# Altium project SmartCantonDevBox_V1_0.PrjPCB
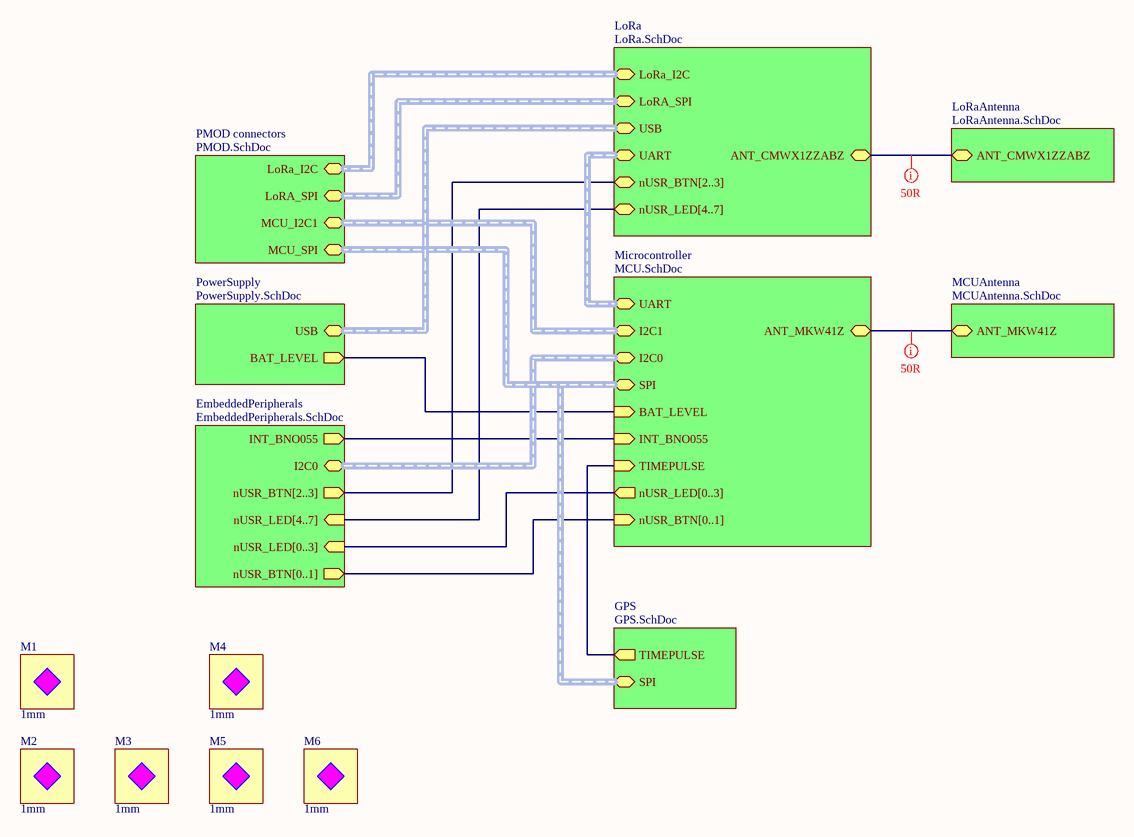
[diagram p0: SmartCantonDevBox_TopPage.SchDoc]
Engineer: David Andrade
9 sheets, 161 parts. Net scope: hierarchical (ports join the sheet entries above them; power ports are global).
Board file: SmartCantonDevBox.PcbDoc
Sheets:
  SmartCantonDevBox_TopPage.SchDoc
    GPS = GPS.SchDoc
    Microcontroller = MCU.SchDoc
    PowerSupply = PowerSupply.SchDoc
    LoRa = LoRa.SchDoc
    LoRaAntenna = LoRaAntenna.SchDoc
    MCUAntenna = MCUAntenna.SchDoc
    EmbeddedPeripherals = EmbeddedPeripherals.SchDoc
    PMOD connectors = PMOD.SchDoc

## Sheet SmartCantonDevBox_TopPage.SchDoc: Top View
size A4; Engineer: David; DocumentNumber: 1; SheetNumber: 1; SheetTotal: 9; Project: SmartCanton Dev Box; Labo: LSN; PageSetup: Record=PageOptions|CenterHorizontal=True|CenterVertical=True|PrintScale=0.97|XCorrection=1.00|YCorrection=1.00|PrintKind=1|BorderSize=5000000|LeftOffset=0|BottomOffset=0|Orientation=2|PaperLength=1000|PaperWidth=1000|Scale=100|PaperSource=7|PrintQuality=-3|MediaType=1|DitherType=10|PrintScaleMode=1|PaperKind=A4 (210 x 297 mm)|PaperIndex=9

### Parts
M1  1mm  [Losange-1mm]
M2  1mm  [Losange-1mm]
M3  1mm  [Losange-1mm]
M4  1mm  [Losange-1mm]
M5  1mm  [Losange-1mm]
M6  1mm  [Losange-1mm]

### Sub-sheets
EmbeddedPeripherals = EmbeddedPeripherals.SchDoc: I2C0 (harness I2C), INT_BNO055 (out), nUSR_LED[0..3] (in), nUSR_LED[4..7] (in), nUSR_BTN[0..1] (out), nUSR_BTN[2..3] (out)
GPS = GPS.SchDoc: SPI (harness SPI), TIMEPULSE (out)
LoRa = LoRa.SchDoc: ANT_CMWX1ZZABZ, UART (harness UART), nUSR_BTN[2..3], nUSR_LED[4..7], USB (harness USB), LoRA_SPI (harness SPI_LoRa), LoRa_I2C (harness I2C_LoRa)
LoRaAntenna = LoRaAntenna.SchDoc: ANT_CMWX1ZZABZ
MCUAntenna = MCUAntenna.SchDoc: ANT_MKW41Z
Microcontroller = MCU.SchDoc: SPI (harness SPI), I2C1 (harness I2C), I2C0 (harness I2C), ANT_MKW41Z, UART (harness UART), BAT_LEVEL (in), TIMEPULSE (in), INT_BNO055 (in), nUSR_LED[0..3] (out), nUSR_BTN[0..1] (in)
PMOD connectors = PMOD.SchDoc: MCU_SPI (harness SPI), MCU_I2C1 (harness I2C), LoRA_SPI (harness SPI_LoRa), LoRa_I2C (harness I2C_LoRa)
PowerSupply = PowerSupply.SchDoc: BAT_LEVEL (out), USB (harness USB)

### Nets
ANT: sheet LoRa/ANT_CMWX1ZZABZ, sheet LoRaAntenna/ANT_CMWX1ZZABZ
ANT_MKW41Z: sheet Microcontroller/ANT_MKW41Z, sheet MCUAntenna/ANT_MKW41Z
BAT_LEVEL: sheet Microcontroller/BAT_LEVEL, sheet PowerSupply/BAT_LEVEL
INT_BNO055: sheet Microcontroller/INT_BNO055, sheet EmbeddedPeripherals/INT_BNO055
TIMEPULSE: sheet GPS/TIMEPULSE, sheet Microcontroller/TIMEPULSE

### Buses and harness runs
bus sheet EmbeddedPeripherals/nUSR_BTN[0..1] = sheet Microcontroller/nUSR_BTN[0..1]
bus sheet EmbeddedPeripherals/nUSR_BTN[2..3] = sheet LoRa/nUSR_BTN[2..3]
bus sheet EmbeddedPeripherals/nUSR_LED[0..3] = sheet Microcontroller/nUSR_LED[0..3]
bus sheet EmbeddedPeripherals/nUSR_LED[4..7] = sheet LoRa/nUSR_LED[4..7]
harness sheet EmbeddedPeripherals/I2C0 = sheet Microcontroller/I2C0
harness sheet GPS/SPI = sheet Microcontroller/SPI = sheet PMOD connectors/MCU_SPI
harness sheet LoRa/LoRa_I2C = sheet PMOD connectors/LoRa_I2C
harness sheet LoRa/LoRA_SPI = sheet PMOD connectors/LoRA_SPI
harness sheet LoRa/UART = sheet Microcontroller/UART
harness sheet LoRa/USB = sheet PowerSupply/USB
harness sheet Microcontroller/I2C1 = sheet PMOD connectors/MCU_I2C1

### Layout directives
rule Impedance Constraint [Min = 49.50    Max = 50.50    ]; net class 50R: ANT, ANT_MKW41Z

### Notes on the sheet
- Title:
- Date:
- Project:
- Engineer:
- Revision:
- Sheet
- of
- Labo:
- File:

### Library data of the parts
M1-M6 = CMP-001-0056-A.1: Losange 1mm

## Sheet GPS.SchDoc: GPS
size A4; Engineer: David; DocumentNumber: 8; SheetNumber: 8; SheetTotal: 9; Project: SmartCanton Dev Box; Labo: LSN; PageSetup: Record=PageOptions|CenterHorizontal=True|CenterVertical=True|PrintScale=0.97|XCorrection=1.00|YCorrection=1.00|PrintKind=1|BorderSize=5000000|LeftOffset=0|BottomOffset=0|Orientation=2|PaperLength=1000|PaperWidth=1000|Scale=100|PaperSource=7|PrintQuality=-3|MediaType=1|DitherType=10|PrintScaleMode=1|PaperKind=A4 (210 x 297 mm)|PaperIndex=9
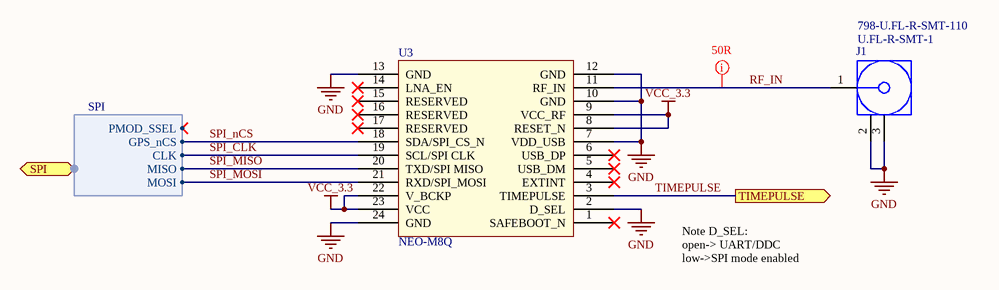
[diagram p1: GPS.SchDoc]

### Parts
J1  U.FL-R-SMT-1  Supplier Part Number 1: 798-U.FL-R-SMT-110  [U.FL-R-SMT-1]
U3  NEO-M8Q  [NEO]

### Ports
SPI (harness SPI), TIMEPULSE (out)

### Harnesses
SPI: CLK, MISO, MOSI, PMOD_SSEL, GPS_nCS

### Nets
GND: J1.2(GND) J1.3(GND) U3.2(D_SEL) U3.7(VDD_USB) U3.10(GND) U3.12(GND) U3.13(GND) U3.24(GND)
VCC_3.3: U3.8(RESET_N) U3.9(VCC_RF) U3.22(V_BCKP) U3.23(VCC)
RF_IN: J1.1(Signal) U3.11(RF_IN)
SPI_CLK: U3.19(SCL/SPI_CLK) ; port SPI.CLK  [project net KW41Z_PMOD_SCK]
SPI_MISO: U3.20(TXD/SPI_MISO) ; port SPI.MISO  [project net KW41Z_PMOD_MISO]
SPI_MOSI: U3.21(RXD/SPI_MOSI) ; port SPI.MOSI  [project net KW41Z_PMOD_MOSI]
SPI_nCS: U3.18(SDA/SPI_CS_N) ; port SPI.GPS_nCS  [project net GPS_nCS]
TIMEPULSE: U3.3(TIMEPULSE) ; port TIMEPULSE

Not connected (* = marked no-connect by the designer): U3 1(SAFEBOOT_N)* 4(EXTINT)* 5(USB_DM)* 6(USB_DP)* 14(LNA_EN)* 15(RESERVED)* 16(RESERVED)* 17(RESERVED)*

### Layout directives
net class 50R; rule Clearance Constraint [Clearance = 6.2mil]: RF_IN

### Notes on the sheet
- Note D_SEL:
  open-> UART/DDC
  low->SPI mode enabled
- Title:
- Date:
- Project:
- Engineer:
- Revision:
- Sheet
- of
- Labo:
- File:

### Library data of the parts
J1 = CMP-001-0013-A.3: Hirose U.FL SMT connector; Datasheet: https://www.hirose.com/product/en/download_file/key_name/U.FL/category/Catalog/doc_file_id/31697/?file_category_id=4&item_id=15&is_series=1; Drawing: https://www.hirose.com/product/en/download_file/key_name/U.FL-R-SMT-1%2810%29/category/Drawing%20(2D)/doc_file_id/37627/?file_category_id=6&item_id=03310472210&is_series=; Supplier 1: Mouser
U3 = CMP-001-0105-A.1: u-blox M8 concurrent GNSS LCC module, TCXO, ROM, SAW, LNA

## Sheet MCU.SchDoc: Bluetooth MCU
size A3; Engineer: David; DocumentNumber: 3; SheetNumber: 3; SheetTotal: 9; Project: SmartCanton Dev Box; Labo: LSN; PageSetup: Record=PageOptions|CenterHorizontal=True|CenterVertical=True|PrintScale=0.97|XCorrection=1.00|YCorrection=1.00|PrintKind=1|BorderSize=5000000|LeftOffset=0|BottomOffset=0|Orientation=2|PaperLength=1000|PaperWidth=1000|Scale=100|PaperSource=7|PrintQuality=-3|MediaType=1|DitherType=10|PrintScaleMode=1|PaperKind=A4 (210 x 297 mm)|PaperIndex=9
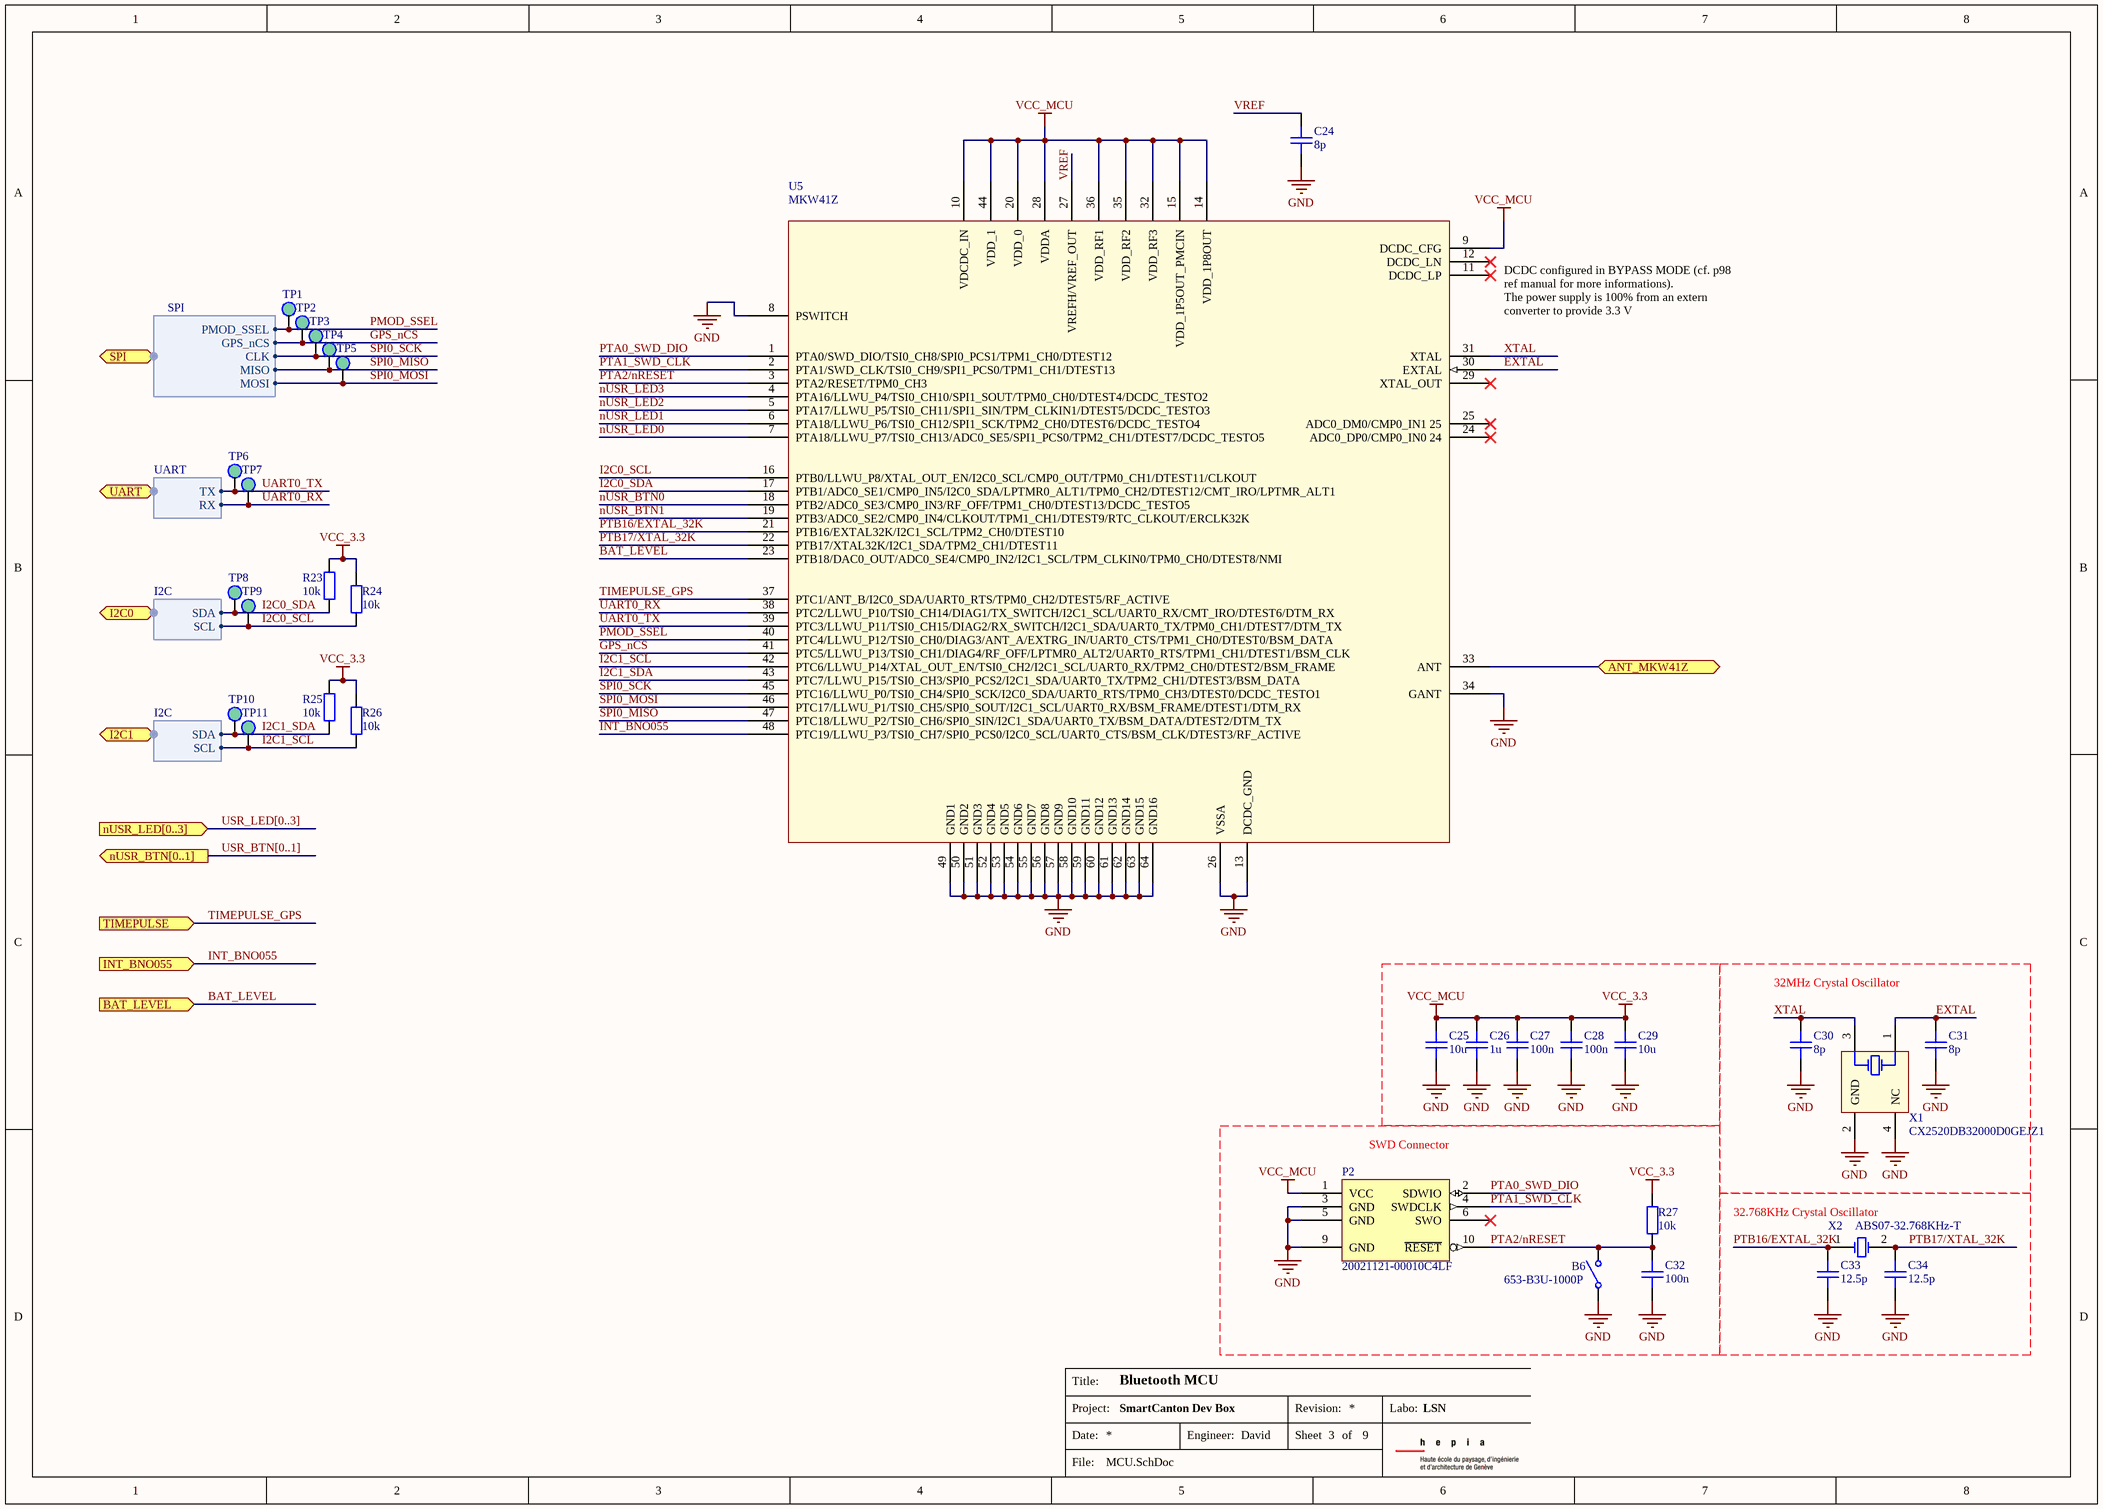
[diagram p2: MCU.SchDoc]

### Parts
B6  653-B3U-1000P  [B3U-1000P]
C24  8p  [CAPC1608X08]
C25  10u  [CAPC1608X08N]
C26  1u  [CAPC1608X08N]
C27  100n  [CAPC1608X08N]
C28  100n  [CAPC1608X08N]
C29  10u  [CAPC1608X08N]
C30  8p  [CAPC1608X08]
C31  8p  [CAPC1608X08]
C32  100n  [CAPC1608X08]
C33  12.5p  [CAPC1608X08]
C34  12.5p  [CAPC1608X08]
P2  20021121-00010C4LF  [PCBComponent]
R23  10k  [RESC1608X06]
R24  10k  [RESC1608X06]
R25  10k  [RESC1608X06]
R26  10k  [RESC1608X06]
R27  10k  [RESC1608X06]
TP1  5015  [5015]  (value not drawn)
TP2  5015  [5015]  (value not drawn)
TP3  5015  [5015]  (value not drawn)
TP4  5015  [5015]  (value not drawn)
TP5  5015  [5015]  (value not drawn)
TP6  5015  [5015]  (value not drawn)
TP7  5015  [5015]  (value not drawn)
TP8  5015  [5015]  (value not drawn)
TP9  5015  [5015]  (value not drawn)
TP10  5015  [5015]  (value not drawn)
TP11  5015  [5015]  (value not drawn)
U5  MKW41Z  [QFN50P700X700X80_HS-49M]
X1  CX2520DB32000D0GEJZ1  [AVX-CX2520DB32000D0GEJZ1-4_V]
X2  ABS07-32.768KHz-T  [ABRA-ABS07-2_V]

### Blocks framed on the sheet
32MHz Crystal Oscillator: C30 C31 X1
SWD Connector: B6 C32 P2 R27
32.768KHz Crystal Oscillator: C33 C34 X2

### Ports
ANT_MKW41Z, BAT_LEVEL (in), I2C0 (harness I2C), I2C1 (harness I2C), INT_BNO055 (in), nUSR_BTN[0..1] (out), nUSR_LED[0..3] (in), SPI (harness SPI), TIMEPULSE (in), UART (harness UART)

### Harnesses
SPI: GPS_nCS, CLK, MISO, MOSI, PMOD_SSEL
UART: TX, RX
I2C: SDA, SCL

### Nets
GND: B6.1 C24.1 C25.1 C26.1 C27.1 C28.1 C29.1 C30.1 C31.1 C32.1 C33.1 C34.1 P2.3(GND) P2.5(GND) P2.9(GND) U5.8(PSWITCH) U5.13(DCDC_GND) U5.26(VSSA) U5.34(GANT) U5.49(GND1) U5.50(GND2) U5.51(GND3) U5.52(GND4) U5.53(GND5) U5.54(GND6) U5.55(GND7) U5.56(GND8) U5.57(GND9) U5.58(GND10) U5.59(GND11) U5.60(GND12) U5.61(GND13) U5.62(GND14) U5.63(GND15) U5.64(GND16) X1.2(GND) X1.4(NC)
VCC_3.3: C25.2 C26.2 C27.2 C28.2 C29.2 P2.1(VCC) R23.2 R24.2 R25.2 R26.2 R27.1 U5.9(DCDC_CFG) U5.10(VDCDC_IN) U5.14(VDD_1P8OUT) U5.15(VDD_1P5OUT_PMCIN) U5.20(VDD_0) U5.28(VDDA) U5.32(VDD_RF3) U5.35(VDD_RF2) U5.36(VDD_RF1) U5.44(VDD_1)  [also labelled VCC_MCU]
ANT_MKW41Z: U5.33(ANT) ; port ANT_MKW41Z
BAT_LEVEL: U5.23(PTB18/DAC0_OUT/ADC0_SE4/CMP0_IN2/I2C1_SCL/TPM_CLKIN0/TPM0_CH0/DTEST8/NMI) ; port BAT_LEVEL
EXTAL: C31.2 U5.30(EXTAL) X1.1(HOT)
GPS_nCS: TP2.1(TP) U5.41(PTC5/LLWU_P13/TSI0_CH1/DIAG4/RF_OFF/LPTMR0_ALT2/UART0_RTS/TPM1_CH1/DTEST1/BSM_CLK) ; port SPI.GPS_nCS
I2C0_SCL: R24.1 TP9.1(TP) U5.16(PTB0/LLWU_P8/XTAL_OUT_EN/I2C0_SCL/CMP0_OUT/TPM0_CH1/DTEST11/CLKOUT) ; port I2C0.SCL
I2C0_SDA: R23.1 TP8.1(TP) U5.17(PTB1/ADC0_SE1/CMP0_IN5/I2C0_SDA/LPTMR0_ALT1/TPM0_CH2/DTEST12/CMT_IRO/LPTMR_ALT1) ; port I2C0.SDA
I2C1_SCL: R26.1 TP11.1(TP) U5.42(PTC6/LLWU_P14/XTAL_OUT_EN/TSI0_CH2/I2C1_SCL/UART0_RX/TPM2_CH0/DTEST2/BSM_FRAME) ; port I2C1.SCL
I2C1_SDA: R25.1 TP10.1(TP) U5.43(PTC7/LLWU_P15/TSI0_CH3/SPI0_PCS2/I2C1_SDA/UART0_TX/TPM2_CH1/DTEST3/BSM_DATA) ; port I2C1.SDA
INT_BNO055: U5.48(PTC19/LLWU_P3/TSI0_CH7/SPI0_PCS0/I2C0_SCL/UART0_CTS/BSM_CLK/DTEST3/RF_ACTIVE) ; port INT_BNO055
nUSR_BTN0: U5.18(PTB2/ADC0_SE3/CMP0_IN3/RF_OFF/TPM1_CH0/DTEST13/DCDC_TESTO5)
nUSR_BTN1: U5.19(PTB3/ADC0_SE2/CMP0_IN4/CLKOUT/TPM1_CH1/DTEST9/RTC_CLKOUT/ERCLK32K)
nUSR_LED0: U5.7(PTA18/LLWU_P7/TSI0_CH13/ADC0_SE5/SPI1_PCS0/TPM2_CH1/DTEST7/DCDC_TESTO5)
nUSR_LED1: U5.6(PTA18/LLWU_P6/TSI0_CH12/SPI1_SCK/TPM2_CH0/DTEST6/DCDC_TESTO4)
nUSR_LED2: U5.5(PTA17/LLWU_P5/TSI0_CH11/SPI1_SIN/TPM_CLKIN1/DTEST5/DCDC_TESTO3)
nUSR_LED3: U5.4(PTA16/LLWU_P4/TSI0_CH10/SPI1_SOUT/TPM0_CH0/DTEST4/DCDC_TESTO2)
PMOD_SSEL: TP1.1(TP) U5.40(PTC4/LLWU_P12/TSI0_CH0/DIAG3/ANT_A/EXTRG_IN/UART0_CTS/TPM1_CH0/DTEST0/BSM_DATA) ; port SPI.PMOD_SSEL  [project net KW41Z_PMOD_SSEL]
PTA0_SWD_DIO: P2.2(SDWIO) U5.1(PTA0/SWD_DIO/TSI0_CH8/SPI0_PCS1/TPM1_CH0/DTEST12)
PTA1_SWD_CLK: P2.4(SWDCLK) U5.2(PTA1/SWD_CLK/TSI0_CH9/SPI1_PCS0/TPM1_CH1/DTEST13)
PTA2/nRESET: B6.2 C32.2 P2.10(~{RESET}) R27.2 U5.3(PTA2/RESET/TPM0_CH3)
PTB16/EXTAL_32K: C33.2 U5.21(PTB16/EXTAL32K/I2C1_SCL/TPM2_CH0/DTEST10) X2.1(X1)
PTB17/XTAL_32K: C34.2 U5.22(PTB17/XTAL32K/I2C1_SDA/TPM2_CH1/DTEST11) X2.2(X2)
SPI0_MISO: TP4.1(TP) U5.47(PTC18/LLWU_P2/TSI0_CH6/SPI0_SIN/I2C1_SDA/UART0_TX/BSM_DATA/DTEST2/DTM_TX) ; port SPI.MISO  [project net KW41Z_PMOD_MISO]
SPI0_MOSI: TP5.1(TP) U5.46(PTC17/LLWU_P1/TSI0_CH5/SPI0_SOUT/I2C1_SCL/UART0_RX/BSM_FRAME/DTEST1/DTM_RX) ; port SPI.MOSI  [project net KW41Z_PMOD_MOSI]
SPI0_SCK: TP3.1(TP) U5.45(PTC16/LLWU_P0/TSI0_CH4/SPI0_SCK/I2C0_SDA/UART0_RTS/TPM0_CH3/DTEST0/DCDC_TESTO1) ; port SPI.CLK  [project net KW41Z_PMOD_SCK]
TIMEPULSE_GPS: U5.37(PTC1/ANT_B/I2C0_SDA/UART0_RTS/TPM0_CH2/DTEST5/RF_ACTIVE) ; port TIMEPULSE  [project net TIMEPULSE]
UART0_RX: TP7.1(TP) U5.38(PTC2/LLWU_P10/TSI0_CH14/DIAG1/TX_SWITCH/I2C1_SCL/UART0_RX/CMT_IRO/DTEST6/DTM_RX) ; port UART.RX
UART0_TX: TP6.1(TP) U5.39(PTC3/LLWU_P11/TSI0_CH15/DIAG2/RX_SWITCH/I2C1_SDA/UART0_TX/TPM0_CH1/DTEST7/DTM_TX) ; port UART.TX
VREF: C24.2 U5.27(VREFH/VREF_OUT)
XTAL: C30.2 U5.31(XTAL) X1.3(HOT)

Not connected (* = marked no-connect by the designer): P2 6(SWO)*; U5 11(DCDC_LP)* 12(DCDC_LN)* 24(ADC0_DP0/CMP0_IN0_24)* 25(ADC0_DM0/CMP0_IN1_25)* 29(XTAL_OUT)*

### Buses and harness runs
bus USR_BTN[0..1] = port nUSR_BTN[0..1]
bus USR_LED[0..3] = port nUSR_LED[0..3]

### Notes on the sheet
- DCDC configured in BYPASS MODE (cf. p98 ref manual for more informations).
  The power supply is 100% from an extern converter to provide 3.3 V
- Title:
- Date:
- Project:
- Engineer:
- Revision:
- Sheet
- of
- Labo:
- File:

### Library data of the parts
B6 = PUSH_BUTTON: Supplier 1: Mouser; Supplier Part Number 1: 653-B3U-1000P
C24 C30 C31 C33 C34 = CMP-001-0010-A.3: MLCC Capacitor 1608; RevisionId: A.2; AccessRights: 2147483647; Folder: LSN\Components\Passifs\Condensateurs\; ContentType: Component; LifeCycleStateGUID: 706004B5-C76E-482E-903B-BA0E4FAE086A; ReleaseDate: 31/10/2016 02:21:03 PM; ContentTypeGUID: CB3C11C4-E317-11DF-B822-12313F0024A2; ItemGUID: 6B05C9AF-D3C2-4723-98C2-0E51694C471A; ItemHRID: CMP-001-0010; FolderGUID: 9DA6C5B0-B134-4C0D-99DA-A840DED25FBD; LifeCycle: New From Design; ComponentType: Capacitor
  C24 C30 C31: Value: 8p
  C33 C34: Value: 12.5p
C25-C29 = CMP-001-0010-A.1: MLCC Capacitor 1608
  C25 C29: Value: 10u
  C26: Value: 1u
  C27 C28: Value: 100n
C32 = CMP-001-0010-A.3: MLCC Capacitor 1608; AccessRights: 2147483647; ContentType: Component; Folder: LSN\Components\Passifs\Condensateurs\; RevisionId: A.2; Value: 100n; ComponentType: Capacitor; ContentTypeGUID: CB3C11C4-E317-11DF-B822-12313F0024A2; FolderGUID: 9DA6C5B0-B134-4C0D-99DA-A840DED25FBD; ItemGUID: 6B05C9AF-D3C2-4723-98C2-0E51694C471A; ItemHRID: CMP-001-0010; LifeCycle: New From Design; LifeCycleStateGUID: 706004B5-C76E-482E-903B-BA0E4FAE086A; ReleaseDate: 31/10/2016 02:21:03 PM
P2 = CMP-001-0019-A.2: Minitek127®  :  1.27x1.27MM BTB, HEADER UNSHROUDED, SMT, 10 POSITIONS; Supplier 1: Mouser; Supplier Part Number 1: 649-202112100010C4LF
R23-R27 = CMP-001-0005-A.4: 1608 resistor; Value: 10k
TP1-TP11 = CMP-001-0108-A.3: Circuit Board Hardware - PCB MINI SMT TEST POINT
U5 = CMP-001-0100-A.1: 2.4 GHz Bluetooth Low Energy ver. 4.2 compliant, Up to 48 MHz ARM® Cortex-M0+ core, On-chip 512/256 KB Flash memory, On-chip 128/64 KB SRAM; Supplier 1: Mouser; Supplier Part Number 1: 841-MKW41Z512VHT4
X1 = CMP-0449-00001-2: Crystal, 32 MHz, 8 pF, -10 to 70 degC, Surface Mount 2.5 x 2.0 mm; Manufacturer: Kyocera; Load Capacitance: 8 pF; Frequency Range: 32000 kHz; Packing: Tape and Reel; Motional Series Resistance: 50 ohm (max); Drive Level: 10uW (100uW max.); ComponentLink3Description: Package Specification; ComponentLink1Description: Manufacturer URL; ComponentLink2Description: Datasheet; PackageDescription: 4-Pin Hand Drawnï¼ŒBody 2.5x2mm; ComponentLink1URL: http://global.kyocera.com/; ComponentLink3URL: http://global.kyocera.com/prdct/electro/pdf/xtal/cx2520db_cs_e.pdf; Operating Temperature: -10 to 70 degC; ComponentLink2URL: http://global.kyocera.com/prdct/electro/pdf/xtal/cx2520db_cs_e.pdf; PartNumber: CX2520DB32000D0GEJZ1; PackageReference: CX2520DB32000D0GEJZ1-4; Mounting Technology: Surface Mount; Supplier 1: Mouser; Supplier Part Number 1: 581-CX2520DB32DGEJZ1
X2 = CMP-0447-00001-2: Crystal, 32.768 kHz, 12.5 pF, -40 to 85 degC, SMD Low Profile 3.2 x 1.5 x 0.9 mm, Tape and Reel; Manufacturer: Abracon; Q Value (Type): 30000; Operation Mode: Flexural Mode (Tuning Fork); Shunt Capacitance (C0): 0.9 to 1.2 pF; Load Capacitance (CL): 12.5 pF; Frequency Tolerance @+25degC: +/- 20 ppm; Drive Level (Type): 0.1 uW; Equivalent Series Resistance (R1): 70 Kohm; Insulation Resistance (Min): 500 Mohm; ComponentLink3URL: http://www.abracon.com/Resonators/ABS07.pdf; PackageDescription: 2-Pin Hand Drawn, Body 3.2x1.5mm, Pitch 2.5mm; Operating Temperature: -40 to 85 degC; ComponentLink2URL: http://www.abracon.com/Resonators/ABS07.pdf; PackageReference: ABS07-2; ComponentLink3Description: Package Specification; ComponentLink1Description: Manufacturer URL; DatasheetVersion: 04.03.13; Mounting Technology: Surface Mount; ComponentLink2Description: Datasheet; ComponentLink1URL: http://www.abracon.com/; PartNumber: ABS07-32.768KHz-T; Packing: Tape and Reel; Frequency: 32.768 kHz; Supplier 1: Mouser; Supplier Part Number 1: 815-ABS07-32.768KHZT

## Sheet PowerSupply.SchDoc: Power Supply
size A4; Engineer: David; DocumentNumber: 2; SheetNumber: 2; SheetTotal: 9; Project: SmartCanton Dev Box; Labo: LSN; PageSetup: Record=PageOptions|CenterHorizontal=True|CenterVertical=True|PrintScale=0.97|XCorrection=1.00|YCorrection=1.00|PrintKind=1|BorderSize=5000000|LeftOffset=0|BottomOffset=0|Orientation=2|PaperLength=1000|PaperWidth=1000|Scale=100|PaperSource=7|PrintQuality=-3|MediaType=1|DitherType=10|PrintScaleMode=1|PaperKind=A4 (210 x 297 mm)|PaperIndex=9; ProjectName: SmartCanton Dev Box
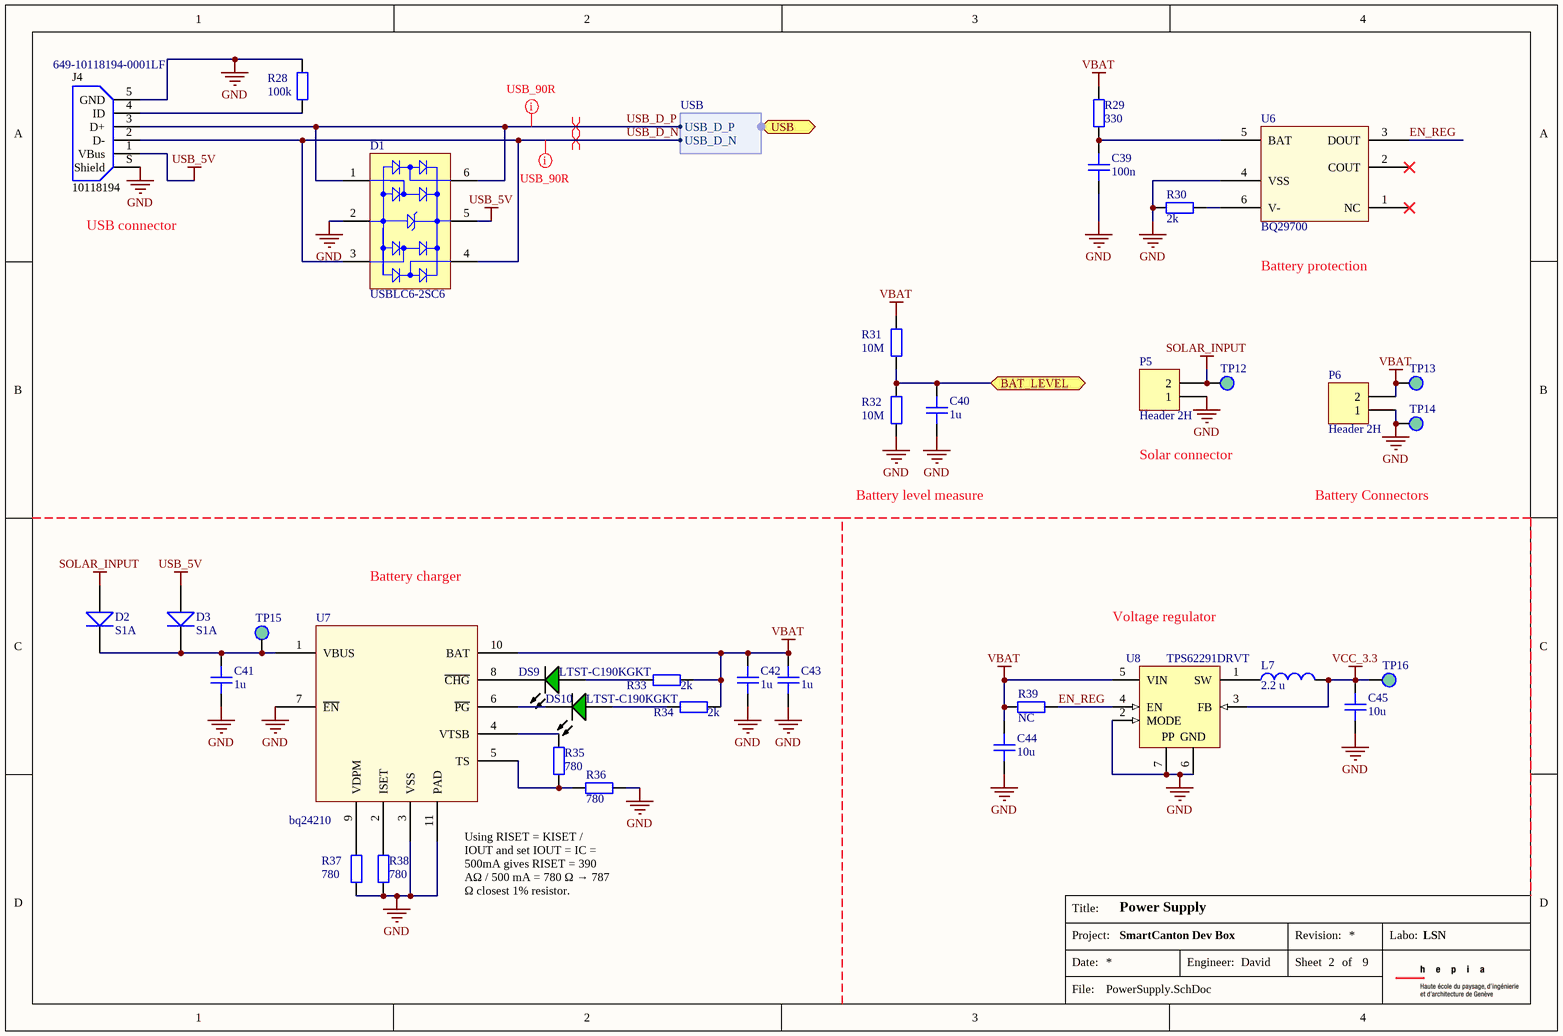
[diagram p3: PowerSupply.SchDoc]

### Parts
C39  100n  [CAPC1608X08]
C40  1u  [CAPC1608X08]
C41  1u  [CAPC1608X08]
C42  1u  [CAPC1608X08]
C43  1u  [CAPC1608X08]
C44  10u  [CAPC2012X14]
C45  10u  [CAPC2012X14]
D1  USBLC6-2SC6  [STM-SOT23-6L_V]
D2  S1A  [DO-214AC]
D3  S1A  [DO-214AC]
DS9  LTST-C190KGKT  [LITE-ON-LTST-C190GKT-2_V]
DS10  LTST-C190KGKT  [LITE-ON-LTST-C190GKT-2_V]
J4  10118194  Supplier Part Number 1: 649-10118194-0001LF  [10118194-0001LF]
L7  2.2 u  [TDK-IND0805-125_V]
P5  Header 2H  [HDR1X2H]
P6  Header 2H  [HDR1X2H]
R28  100k  [RESC1608X06]
R29  330  [RESC1608X06]
R30  2k  [RESC1608X06]
R31  10M  [RESC1608X06]
R32  10M  [RESC1608X06]
R33  2k  [RESC1608X06]
R34  2k  [RESC1608X06]
R35  780  [RESC1608X06]
R36  780  [RESC1608X06]
R37  780  [RESC1608X06]
R38  780  [RESC1608X06]
R39  NC  [RESC1608X06]
TP12  5015  [5015]  (value not drawn)
TP13  5015  [5015]  (value not drawn)
TP14  5015  [5015]  (value not drawn)
TP15  5015  [5015]  (value not drawn)
TP16  5015  [5015]  (value not drawn)
U6  BQ29700  [SON50P150X75-6M]
U7  bq24210  [WSON50P200X300X80-11N]
U8  TPS62291DRVT  [DRV0006A_V]

### Ports
BAT_LEVEL, USB (harness USB)

### Harnesses
USB: USB_D_P, USB_D_N

### Nets
GND: C39.1 C40.1 C41.1 C42.1 C43.1 C44.2 C45.2 D1.2(GND) J4.5(GND) J4.S(Shield) P5.1 P6.1 R28.2 R30.1 R32.1 R36.1 R37.1 R38.1 TP14.1(TP) U6.4(VSS) U7.3(VSS) U7.7(~{EN}) U7.11(PAD) U8.2(MODE) U8.6(GND) U8.7(EP)
SOLAR_INPUT: D2.A P5.2 TP12.1(TP)
USB_5V: D1.5(VBUS) D3.A J4.1(VBus)
VBAT: C42.2 C43.2 C44.1 P6.2 R29.2 R31.2 R33.1 R34.1 R39.2 TP13.1(TP) U7.10(BAT) U8.5(VIN)
VCC_3.3: C45.1 L7.2 TP16.1(TP) U8.3(FB)
BAT_LEVEL: C40.2 R31.1 R32.2 ; port BAT_LEVEL
EN_REG: R39.1 U6.3(DOUT) U8.4(EN)
USB_D_N: D1.3(I/O_2) D1.4(I/O_3) J4.2(D-) ; port USB.USB_D_N
USB_D_P: D1.1(I/O_1) D1.6(I/O_4) J4.3(D+) ; port USB.USB_D_P
NetC39_2: C39.2 R29.1 U6.5(BAT)
NetC41_2: C41.2 D2.K D3.K TP15.1(TP) U7.1(VBUS)
NetDS9_1: DS9.1(A) R33.2
NetDS9_2: DS9.2(K) U7.8(~{CHG})
NetDS10_1: DS10.1(A) R34.2
NetDS10_2: DS10.2(K) U7.6(~{PG})
NetJ4_4: J4.4(ID) R28.1
NetL7_1: L7.1 U8.1(SW)
NetR30_2: R30.2 U6.6(V-)
NetR35_1: R35.1 R36.2 U7.5(TS)
NetR35_2: R35.2 U7.4(VTSB)
NetR37_2: R37.2 U7.9(VDPM)
NetR38_2: R38.2 U7.2(ISET)

Not connected (* = marked no-connect by the designer): U6 1(NC)* 2(COUT)*

### Layout directives
differential pair; net class USB_90R: USB_D_N, USB_D_P
rule Impedance Constraint [Min = 90.00    Max = 90.00    ]; net class USB_90R: USB_D_N, USB_D_P

### Notes on the sheet
- (near J4) USB connector
- (near U6) Battery protection
- Battery level measure
- Solar connector
- Battery Connectors
- Battery charger
- Voltage regulator
- Using RISET = KISET / IOUT and set IOUT = IC = 500mA gives RISET = 390 AΩ / 500 mA = 780 Ω → 787 Ω closest 1% resistor.
- Title:
- Date:
- Project:
- Engineer:
- Revision:
- Sheet
- of
- Labo:
- File:
- (in symbol CMP-00017-A.1) PP

### Library data of the parts
C39-C43 = CMP-001-0010-A.3: as C24 on sheet MCU; LifeCycleStateGUID: 706004B5-C76E-482E-903B-BA0E4FAE086A; ReleaseDate: 31/10/2016 02:21:03 PM; ContentTypeGUID: CB3C11C4-E317-11DF-B822-12313F0024A2; ItemGUID: 6B05C9AF-D3C2-4723-98C2-0E51694C471A; ItemHRID: CMP-001-0010; FolderGUID: 9DA6C5B0-B134-4C0D-99DA-A840DED25FBD; LifeCycle: New From Design; ComponentType: Capacitor
  C39: Value: 100n
  C40-C43: Value: 1u
C44 C45 = CMP-001-0011-A.3: MLCC Capacitor 2012; RevisionId: A.2; AccessRights: 2147483647; Folder: LSN\Components\Passifs\Condensateurs\; ContentType: Component; LifeCycleStateGUID: 706004B5-C76E-482E-903B-BA0E4FAE086A; ReleaseDate: 31/10/2016 02:37:45 PM; ContentTypeGUID: CB3C11C4-E317-11DF-B822-12313F0024A2; ItemGUID: A3557974-B927-469A-A63C-1E583F58844C; ItemHRID: CMP-001-0011; FolderGUID: 9DA6C5B0-B134-4C0D-99DA-A840DED25FBD; LifeCycle: New From Design; ComponentType: Capacitor; Value: 10u
D1 = CMP-2000-05378-1: Very low capacitance ESD protection, 3.5 pF, -40 to 125 degC, 6-Pin SOT23, RoHS, Tape and Reel; Manufacturer: STMicroelectronics; Polarity: Uni-Directional; Clamping Voltage: 17V; Rad Hardened: No; Product Height (mm): 1.3mm; Leakage Current (Max): 0.15uA; Product Length (mm): 3.05mm; Number of Elements: 1; Peak Pulse Current: 5A; Configuration: Dual; Reverse Breakdown Voltage: 6V; Working Voltage (Max): 5V; Capacitance Value: 3.5pF; Suppressor Type: DiodeArrays; Product Depth (mm): 1.75mm; Test Current (It): 1mA; Package / Case: SOT-23; Operating Temperature Max Deg. C: 125C; Package Description: 6-Pin Small Outline Transistor, Body 2.925 x 1.625 mm, Pitch 0.95 mm; Package Reference: SOT23-6L; Datasheet Version: Rev. 5, 10/2011; Operating Temperature Min Deg. C: -40C; Mounting Style: SurfaceMount; Direction Type: Uni-Directional; Mounting: SurfaceMount; Pin Count: 6; Leakage Current: 0.15uA; Packaging: TapeandReel; Operating Temperature Classification: Automotive; Clamping Voltage (Max): 17V; Manufacturer URL: http://www.st.com/; Reverse Stand-off Voltage: 5V; Datasheet URL: http://www.st.com/st-web-ui/static/active/en/resource/technical/document/datasheet/CD00050750.pdf; Working Voltage: 5V; Operating Temp Range: -40Cto125C; Supplier 1: Mouser; Supplier Part Number 1: 511-USBLC6-2SC6
D2 D3 = CMP-001-0034-A.1: General-Purpose Rectifier, Vrrm = 50V
DS9 DS10 = CMP-00026-A.1: LED Uni-Color Green, 75 mW, 5 V, -30 to 85 degC, 2-Pin SMD, RoHS, Tape and Reel; Manufacturer: Lite-On; Reverse Voltage: 5V; Product Depth (mm): 0.8mm; Forward Voltage: 2.4V; Rad Hardened: No; High Brightness: Yes; Forward Current: 30mA; Viewing Angle: 130deg; Test Current (It): 20mA; Emitting Color: YellowGreen; Number of Elements: 1; Luminous Intensity: 35mcd; Chip Material: AlGaInP; Shape Type: Rectangular; Dominant Wave Length: 571nm; Peak Wavelength: 574nm; Main Category: ChipLED; DELETED: Compliant; Product Length (mm): 1.6mm; Power Dissipation: 75W; Package Reference: C190KGKT; Mounting: SurfaceMount; Package Description: 2-Pin Surface Mount Device, Body 1.6 x 0.8 mm; Datasheet Version: Jul-15; Operating Temperature Classification: Industrial; Packaging: TapeandReel; Lens Dimensions: 1.1X0.8X0.52mm; Type: Uni-Color; Manufacturer URL: http://www.us.liteon.com/; Datasheet URL: http://datasheet.octopart.com/LTST-C190KGKT-Lite-On-datasheet-43775815.pdf; Product Height (mm): 0.8mm; Operating Temp Range: -55Cto85C; Pin Count: 2; Package Type: ChipLed; Lum Intensity: 35mcd; Supplier 1: Mouser; Supplier Part Number 1: 859-LTST-C190KGKT
J4 = CMP-001-0075-A.1: Supplier 1: Mouser
L7 = CMP-0266-00001-1: Multilayer Inductor, 2.2 uH, ±20%, 300 mOhm, 50MHz, 0805(2012); PartNumber: MLZ2012N100LT; DC Resistance: 0.3 Ohm; PackageReference: IND0805-125; ComponentLink1URL: http://www.global.tdk.com/; DatasheetVersion: 05/2013; ComponentLink2Description: Datasheet; ComponentLink1Description: Manufacturer URL; Mounting Technology: Suface Mount; ComponentLink2URL: http://www.tdk.co.jp/tcfx01/c533_mlz.pdf; PackageDescription: 2-Pin SMT Inductor, 2 x 1.25 mm Body; Supplier 1: Mouser; Supplier Part Number 1: 810-MLZ2012N2R2LT000
P5 P6 = Header 2H: Header, 2-Pin, Right Angle; LatestRevisionDate: 17-Jul-2002; LatestRevisionNote: Re-released for DXP Platform.; Publisher: Altium Limited
  P5: Supplier 1: Mouser; Supplier Part Number 1: 538-22-05-3021
  P6: Supplier 1: Digi-Key; Supplier Part Number 1: WM4300-ND
R28-R39 = CMP-001-0005-A.4: 1608 resistor
  R28: Value: 100k
  R29: Value: 330
  R30 R33 R34: Value: 2k
  R31 R32: Value: 10M
  R35-R38: Value: 780
  R39: Value: NC
TP12-TP16 = CMP-001-0108-A.3: as TP1 on sheet MCU
U6 = CMP-001-0114-A.2: Supplier 1: Mouser; Supplier Part Number 1: 595-BQ29700DSET
U7 = CMP-001-0111-A.1: 800-mA, Single-Input, Single-Cell Li-Ion Battery Solar Charger; Supplier 1: Mouser; Supplier Part Number 1: 595-BQ24210DQCT
U8 = CMP-00017-A.1: Buck Step Down Regulator with 2.3 to 6 V Input and 3.3 V Output, -40 to 85 degC, 6-Pin SON (DRV), Green (RoHS & no Sb/Br); Manufacturer: Texas Instruments; Preset Vout(V): 3.3; Switch Current Limit(Typ)(A): 1.4; Synchronous Rectification: TRUE; Duty Cycle(Max)(%): 100; Iout(Max)(A): 1; Vin(Max)(V): 6; Iq(Typ)(mA): 0.015; Rating: Catalog; SubFamily: Step-Down Regulator; Vin(Min)(V): 2.3; PartNumber: TPS62291DRVT; Mounting Technology: Surface Mount; ComponentLink2Description: Package Specification; Topology: Buck; ComponentLink1Description: Datasheet; Eco-Plan: Green (RoHS & no Sb/Br); Regulated Outputs(#): 1; ComponentLink1URL: http://www.ti.com/general/docs/lit/getliterature.tsp?genericPartNumber=TPS62291&fileType=pdf; DatasheetVersion: SLVS764C; ComponentLink3Description: URL Link1; Vout(Min)(V): 3.3; Vout(Max)(V): 3.3; PackageDescription: 6-Pin Plastic Small Outline No-Lead, 2 x 2 x 0.8 mm Body, 0.65 mm Pitch, Exposed Pad; ComponentLink2URL: http://www.ti.com/litv/pdf/mpds216d; PackageReference: DRV0006A; ComponentLink3URL: Samples URL:http://www.ti.com/product/tps62291#samples; PackageVersion: revE, Oct-2010; Supplier 1: Mouser; Supplier Part Number 1: 595-TPS62291DRVT

## Sheet LoRa.SchDoc: LoRa MCU
size A4; Engineer: David; DocumentNumber: 5; SheetNumber: 5; SheetTotal: 9; Project: SmartCanton Dev Box; Labo: LSN; PageSetup: Record=PageOptions|CenterHorizontal=True|CenterVertical=True|PrintScale=0.97|XCorrection=1.00|YCorrection=1.00|PrintKind=1|BorderSize=5000000|LeftOffset=0|BottomOffset=0|Orientation=2|PaperLength=1000|PaperWidth=1000|Scale=100|PaperSource=7|PrintQuality=-3|MediaType=1|DitherType=10|PrintScaleMode=1|PaperKind=A4 (210 x 297 mm)|PaperIndex=9
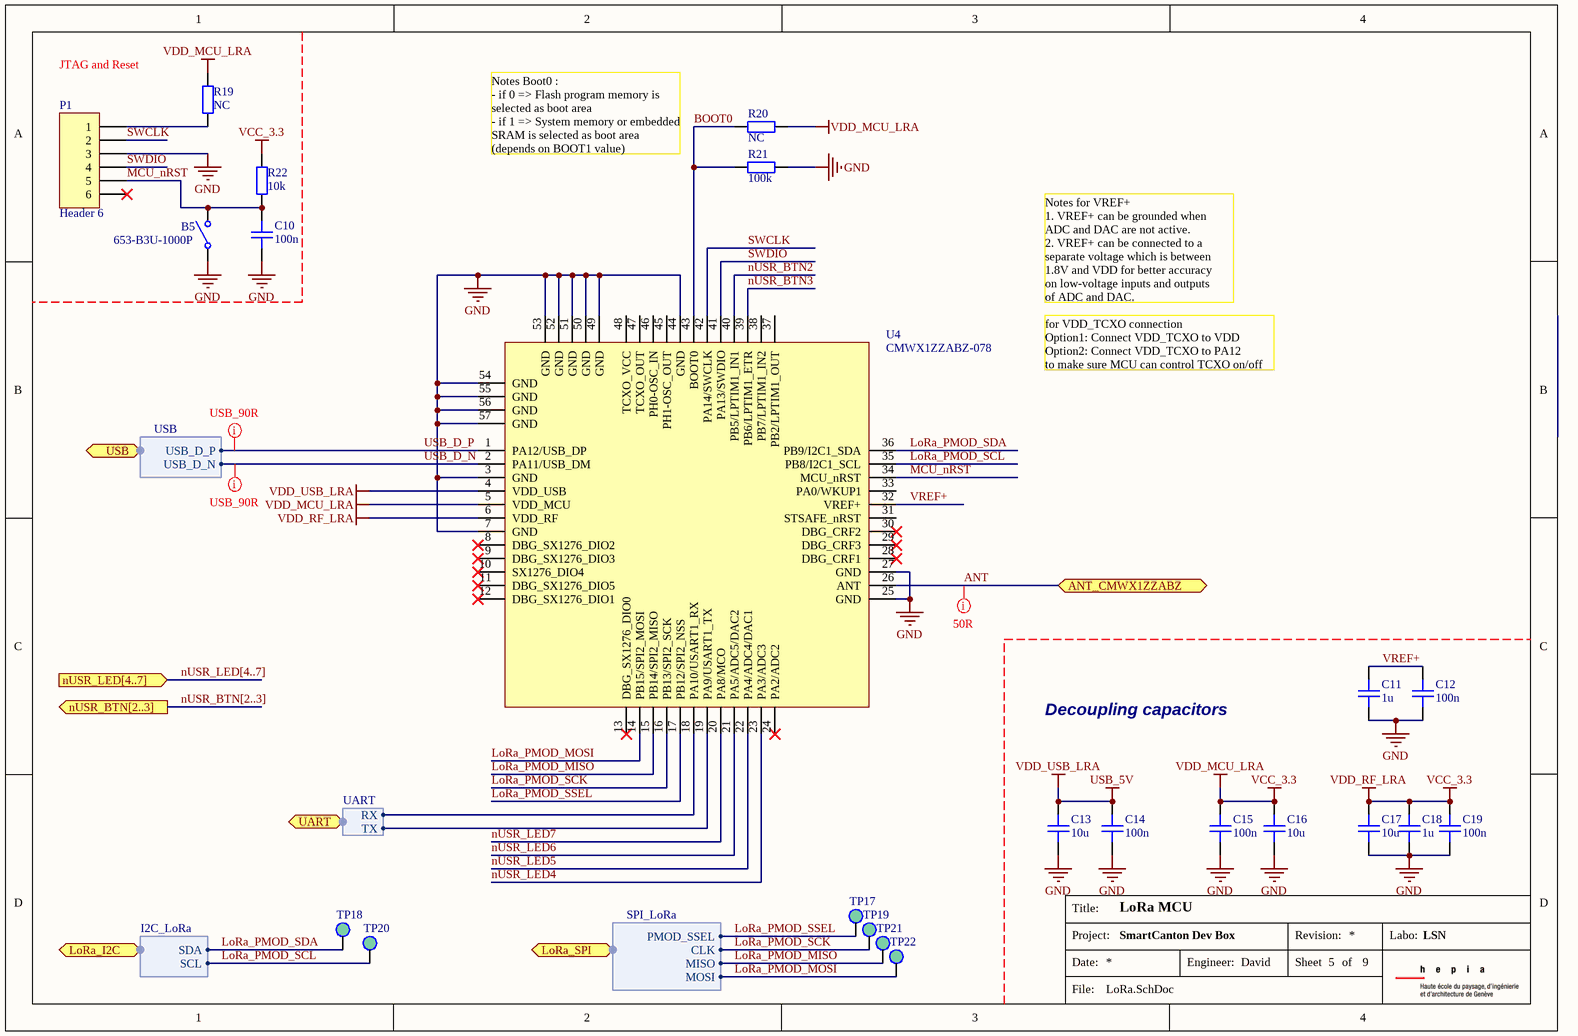
[diagram p4: LoRa.SchDoc]

### Parts
B5  653-B3U-1000P  [B3U-1000P]
C10  100n  [CAPC1608X08]
C11  1u  [CAPC1608X08N]
C12  100n  [CAPC1608X08N]
C13  10u  [CAPC1608X08N]
C14  100n  [CAPC1608X08N]
C15  100n  [CAPC1608X08N]
C16  10u  [CAPC1608X08N]
C17  10u  [CAPC1608X08N]
C18  1u  [CAPC1608X08N]
C19  100n  [CAPC1608X08N]
P1  Header 6  [HDR1X6]
R19  NC  [RESC1608X06]
R20  NC  [RESC1608X06]
R21  100k  [RESC1608X06]
R22  10k  [RESC1608X06]
TP17  5015  [5015]  (value not drawn)
TP18  5015  [5015]  (value not drawn)
TP19  5015  [5015]  (value not drawn)
TP20  5015  [5015]  (value not drawn)
TP21  5015  [5015]  (value not drawn)
TP22  5015  [5015]  (value not drawn)
U4  CMWX1ZZABZ-078  [CMWX1ZZABZ-078]

### Ports
ANT_CMWX1ZZABZ, LoRa_I2C (harness I2C_LoRa), LoRa_SPI (harness SPI_LoRa), nUSR_BTN[2..3] (out), nUSR_LED[4..7] (in), UART (harness UART), USB (harness USB)

### Harnesses
UART: RX, TX
SPI_LoRa: PMOD_SSEL, CLK, MISO, MOSI
I2C_LoRa: SDA, SCL
USB: USB_D_P, USB_D_N

### Nets
GND: B5.1 C10.1 C11.1 C12.1 C13.1 C14.1 C15.1 C16.1 C17.1 C18.1 C19.1 P1.3 R21.2 U4.3(GND) U4.7(GND) U4.25(GND) U4.27(GND) U4.44(GND) U4.49(GND) U4.50(GND) U4.51(GND) U4.52(GND) U4.53(GND) U4.54(GND) U4.55(GND) U4.56(GND) U4.57(GND)
USB_5V: C13.2 C14.2 U4.4(VDD_USB)  [also labelled VDD_USB_LRA]
VCC_3.3: C15.2 C16.2 C17.2 C18.2 C19.2 R19.1 R20.2 R22.1 U4.5(VDD_MCU) U4.6(VDD_RF)  [also labelled VDD_MCU_LRA, VDD_RF_LRA]
ANT: U4.26(ANT) ; port ANT_CMWX1ZZABZ
BOOT0: R20.1 R21.1 U4.43(BOOT0)
LoRa_PMOD_MISO: TP21.1(TP) U4.15(PB14/SPI2_MISO) ; port LoRa_SPI.MISO
LoRa_PMOD_MOSI: TP22.1(TP) U4.14(PB15/SPI2_MOSI) ; port LoRa_SPI.MOSI
LoRa_PMOD_SCK: TP19.1(TP) U4.16(PB13/SPI2_SCK) ; port LoRa_SPI.CLK
LoRa_PMOD_SCL: TP20.1(TP) U4.35(PB8/I2C1_SCL) ; port LoRa_I2C.SCL
LoRa_PMOD_SDA: TP18.1(TP) U4.36(PB9/I2C1_SDA) ; port LoRa_I2C.SDA
LoRa_PMOD_SSEL: TP17.1(TP) U4.17(PB12/SPI2_NSS) ; port LoRa_SPI.PMOD_SSEL
MCU_nRST: B5.2 C10.2 P1.5 R22.2 U4.34(MCU_nRST)
nUSR_BTN2: U4.40(PB5/LPTIM1_IN1)
nUSR_BTN3: U4.39(PB6/LPTIM1_ETR)
nUSR_LED4: U4.23(PA3/ADC3)
nUSR_LED5: U4.22(PA4/ADC4/DAC1)
nUSR_LED6: U4.21(PA5/ADC5/DAC2)
nUSR_LED7: U4.20(PA8/MCO)
SWCLK: P1.2 U4.42(PA14/SWCLK)
SWDIO: P1.4 U4.41(PA13/SWDIO)
UART0_RX: U4.18(PA10/USART1_RX) ; port UART.RX
UART0_TX: U4.19(PA9/USART1_TX) ; port UART.TX
USB_D_N: U4.2(PA11/USB_DM) ; port USB.USB_D_N
USB_D_P: U4.1(PA12/USB_DP) ; port USB.USB_D_P
VREF+: C11.2 C12.2 U4.32(VREF+)
NetP1_1: P1.1 R19.2

Not connected (* = marked no-connect by the designer): P1 6*; U4 8(DBG_SX1276_DIO2)* 9(DBG_SX1276_DIO3)* 10(SX1276_DIO4)* 11(DBG_SX1276_DIO5)* 12(DBG_SX1276_DIO1)* 13(DBG_SX1276_DIO0)* 24(PA2/ADC2)* 28(DBG_CRF1)* 29(DBG_CRF3)* 30(DBG_CRF2)* 31(STSAFE_nRST) 33(PA0/WKUP1) 37(PB2/LPTIM1_OUT) 38(PB7/LPTIM1_IN2) 45(PH1-OSC_OUT) 46(PH0-OSC_IN) 47(TCXO_OUT) 48(TCXO_VCC)

### Buses and harness runs
bus nUSR_BTN[2..3] = port nUSR_BTN[2..3]
bus nUSR_LED[4..7] = port nUSR_LED[4..7]

### Layout directives
rule Impedance Constraint [Min = 49.50    Max = 50.50    ]; net class 50R: ANT
rule Impedance Constraint [Min = 90.00    Max = 90.00    ]; net class USB_90R: USB_D_N, USB_D_P

### Notes on the sheet
- JTAG and Reset
- Notes Boot0 :
  - if 0 => Flash program memory is selected as boot area
  - if 1 => System memory or embedded SRAM is selected as boot area (depends on BOOT1 value)
- Notes for VREF+
  1. VREF+ can be grounded when
  ADC and DAC are not active.
  2. VREF+ can be connected to a
  separate voltage which is between
  1.8V and VDD for better accuracy
  on low-voltage inputs and outputs
  of ADC and DAC.
- for VDD_TCXO connection
  Option1: Connect VDD_TCXO to VDD
  Option2: Connect VDD_TCXO to PA12
  to make sure MCU can control TCXO on/off
- Decoupling capacitors
- Title:
- Date:
- Project:
- Engineer:
- Revision:
- Sheet
- of
- Labo:
- File:

### Library data of the parts
B5 = PUSH_BUTTON: Supplier 1: Mouser; Supplier Part Number 1: 653-B3U-1000P
C10 = CMP-001-0010-A.3: as C32 on sheet MCU; Value: 100n; ComponentType: Capacitor; ContentTypeGUID: CB3C11C4-E317-11DF-B822-12313F0024A2; FolderGUID: 9DA6C5B0-B134-4C0D-99DA-A840DED25FBD; ItemGUID: 6B05C9AF-D3C2-4723-98C2-0E51694C471A; ItemHRID: CMP-001-0010; LifeCycle: New From Design; LifeCycleStateGUID: 706004B5-C76E-482E-903B-BA0E4FAE086A; ReleaseDate: 31/10/2016 02:21:03 PM
C11-C19 = CMP-001-0010-A.1: MLCC Capacitor 1608
  C11 C18: Value: 1u
  C12 C14 C15 C19: Value: 100n
  C13 C16 C17: Value: 10u
P1 = Header 6: Header, 6-Pin; LatestRevisionDate: 17-Jul-2002; LatestRevisionNote: Re-released for DXP Platform.; Publisher: Altium Limited
R19-R22 = CMP-001-0005-A.4: 1608 resistor
  R19 R20: Value: NC
  R21: Value: 100k
  R22: Value: 10k
TP17-TP22 = CMP-001-0108-A.3: as TP1 on sheet MCU
U4 = CMP-001-0102-A.1: RF Modules Type ABZ LoRa Module MCU - STM32L082; Supplier 1: Mouser; Supplier Part Number 1: 81-CMWX1ZZABZ-078

## Sheet LoRaAntenna.SchDoc: LoRa Antenna
size A4; Engineer: David; DocumentNumber: 6; SheetNumber: 6; SheetTotal: 9; Project: SmartCanton Dev Box; Labo: LSN; PageSetup: Record=PageOptions|CenterHorizontal=True|CenterVertical=True|PrintScale=0.97|XCorrection=1.00|YCorrection=1.00|PrintKind=1|BorderSize=5000000|LeftOffset=0|BottomOffset=0|Orientation=2|PaperLength=1000|PaperWidth=1000|Scale=100|PaperSource=7|PrintQuality=-3|MediaType=1|DitherType=10|PrintScaleMode=1|PaperKind=A4 (210 x 297 mm)|PaperIndex=9
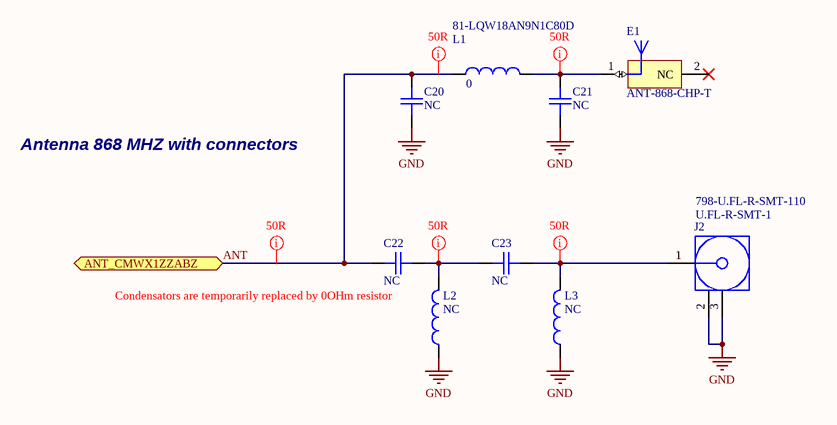
[diagram p5: LoRaAntenna.SchDoc]

### Parts
C20  NC  [CAPC1608X08]
C21  NC  [CAPC1608X08]
C22  NC  [CAPC1608X08]
C23  NC  [CAPC1608X08]
E1  ANT-868-CHP-T  [ANT-868-916-CHP]
J2  U.FL-R-SMT-1  Supplier Part Number 1: 798-U.FL-R-SMT-110  [U.FL-R-SMT-1]
L1  0  Supplier Part Number 1: 81-LQW18AN9N1C80D  [INDC1608X08]
L2  NC  [INDC1608X08]
L3  NC  [INDC1608X08]

### Ports
ANT_CMWX1ZZABZ

### Nets
GND: C20.1 C21.1 J2.2(GND) J2.3(GND) L2.1 L3.1
ANT: C20.2 C22.1 L1.1 ; port ANT_CMWX1ZZABZ
NetC21_2: C21.2 E1.1(FEED) L1.2
NetC22_2: C22.2 C23.1 L2.2
NetC23_2: C23.2 J2.1(Signal) L3.2

Not connected (* = marked no-connect by the designer): E1 2(NC)*

### Layout directives
rule Impedance Constraint [Min = 49.50    Max = 50.50    ]; net class 50R: ANT, NetC21_2, NetC22_2, NetC23_2

### Notes on the sheet
- Antenna 868 MHZ with connectors
- (near L2) Condensators are temporarily replaced by 0OHm resistor
- Title:
- Date:
- Project:
- Engineer:
- Revision:
- Sheet
- of
- Labo:
- File:

### Library data of the parts
C20-C23 = CMP-001-0010-A.3: as C24 on sheet MCU; LifeCycleStateGUID: 706004B5-C76E-482E-903B-BA0E4FAE086A; ReleaseDate: 31/10/2016 02:21:03 PM; ContentTypeGUID: CB3C11C4-E317-11DF-B822-12313F0024A2; ItemGUID: 6B05C9AF-D3C2-4723-98C2-0E51694C471A; ItemHRID: CMP-001-0010; FolderGUID: 9DA6C5B0-B134-4C0D-99DA-A840DED25FBD; LifeCycle: New From Design; ComponentType: Capacitor; Value: NC
E1 = CMP-00015-A.1: 1/4-wave Monopole Ultra-Compact Chip Antenna, CHP Series, 868MHz, Tape and Reel; Note2: Pin 1 is feed terminal, Pin 2 is for physical support only.; PCB_Layout: Complies with manufacturer's recommendation.; Note1: No ground planes or traces under the antenna; DatasheetVersion: Jan-2009; PackageReference: ANT-868-916-CHP; PackageDescription: SMD Ceramic Antenna, CHP Series, 868/916MHz, 2-Leads, 16.0 x 3.0 x 1.7 mm Body; PackageVersion: Jan-2009; Supplier 1: Mouser; Supplier Part Number 1: 712-ANT-868-CHP-T
J2 = CMP-001-0013-A.3: Hirose U.FL SMT connector; Datasheet: https://www.hirose.com/product/en/download_file/key_name/U.FL/category/Catalog/doc_file_id/31697/?file_category_id=4&item_id=15&is_series=1; Drawing: https://www.hirose.com/product/en/download_file/key_name/U.FL-R-SMT-1%2810%29/category/Drawing%20(2D)/doc_file_id/37627/?file_category_id=6&item_id=03310472210&is_series=; Supplier 1: Mouser
L1-L3 = CMP-001-0101-A.4: Ferrite Beads 1608; RevisionId: A.3; AccessRights: 2147483647; Folder: LSN\Components\Passifs\Inductances\; ContentType: Component; LifeCycleStateGUID: 706004B5-C76E-482E-903B-BA0E4FAE086A; ReleaseDate: 31/07/2017 06:40:06 PM; ContentTypeGUID: CB3C11C4-E317-11DF-B822-12313F0024A2; ItemGUID: 17F6FBB7-027A-4BA7-9144-FCD7399F32FE; ItemHRID: CMP-001-0101; FolderGUID: CF708A04-0EC7-4EEE-8F3D-D187CFC5366D; LifeCycle: New From Design
  L1: value: 0; Supplier 1: Mouser
  L2 L3: value: NC

## Sheet MCUAntenna.SchDoc: Bluetooth MCU Antenna
size A4; Engineer: David; DocumentNumber: 4; SheetNumber: 4; SheetTotal: 9; Project: SmartCanton Dev Box; Labo: LSN; PageSetup: Record=PageOptions|CenterHorizontal=True|CenterVertical=True|PrintScale=0.97|XCorrection=1.00|YCorrection=1.00|PrintKind=1|BorderSize=5000000|LeftOffset=0|BottomOffset=0|Orientation=2|PaperLength=1000|PaperWidth=1000|Scale=100|PaperSource=7|PrintQuality=-3|MediaType=1|DitherType=10|PrintScaleMode=1|PaperKind=A4 (210 x 297 mm)|PaperIndex=9
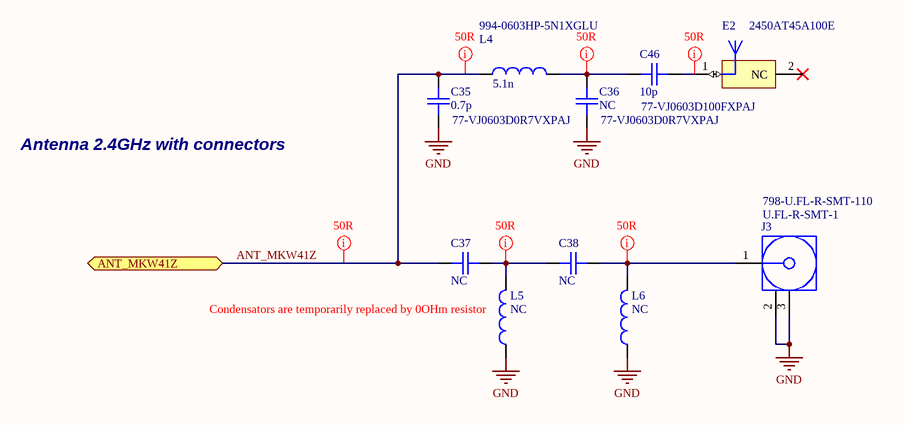
[diagram p6: MCUAntenna.SchDoc]

### Parts
C35  0.7p  Supplier Part Number 1: 77-VJ0603D0R7VXPAJ  [CAPC1608X08]
C36  NC  Supplier Part Number 1: 77-VJ0603D0R7VXPAJ  [CAPC1608X08]
C37  NC  [CAPC1608X08]
C38  NC  [CAPC1608X08]
C46  10p  Supplier Part Number 1: 77-VJ0603D100FXPAJ  [CAPC1608X08]
E2  2450AT45A100E  [Antenne 2.4ghz Ceramique]
J3  U.FL-R-SMT-1  Supplier Part Number 1: 798-U.FL-R-SMT-110  [U.FL-R-SMT-1]
L4  5.1n  Supplier Part Number 1: 994-0603HP-5N1XGLU  [INDC1608X08]
L5  NC  [INDC1608X08]
L6  NC  [INDC1608X08]

### Ports
ANT_MKW41Z

### Nets
GND: C35.1 C36.1 J3.2(GND) J3.3(GND) L5.1 L6.1
ANT_MKW41Z: C35.2 C37.1 L4.1 ; port ANT_MKW41Z
NetC36_2: C36.2 C46.1 L4.2
NetC37_2: C37.2 C38.1 L5.2
NetC38_2: C38.2 J3.1(Signal) L6.2
NetC46_2: C46.2 E2.1(FEED)

Not connected (* = marked no-connect by the designer): E2 2(NC)*

### Layout directives
rule Impedance Constraint [Min = 49.50    Max = 50.50    ]; net class 50R: ANT_MKW41Z, NetC36_2, NetC37_2, NetC38_2, NetC46_2

### Notes on the sheet
- Antenna 2.4GHz with connectors
- (near L5) Condensators are temporarily replaced by 0OHm resistor
- Title:
- Date:
- Project:
- Engineer:
- Revision:
- Sheet
- of
- Labo:
- File:

### Library data of the parts
C35-C38 C46 = CMP-001-0010-A.3: as C24 on sheet MCU; LifeCycleStateGUID: 706004B5-C76E-482E-903B-BA0E4FAE086A; ReleaseDate: 31/10/2016 02:21:03 PM; ContentTypeGUID: CB3C11C4-E317-11DF-B822-12313F0024A2; ItemGUID: 6B05C9AF-D3C2-4723-98C2-0E51694C471A; ItemHRID: CMP-001-0010; FolderGUID: 9DA6C5B0-B134-4C0D-99DA-A840DED25FBD; LifeCycle: New From Design; ComponentType: Capacitor
  C35: Value: 0.7p; Supplier 1: Mouser
  C36: Value: NC; Supplier 1: Mouser
  C37 C38: Value: NC
  C46: Value: 10p; Supplier 1: Mouser
E2 = CMP-001-0103-A.2: Antennas 2.45GHz ANTENNA HIGH GAIN (VERT); Supplier 1: Mouser; Supplier Part Number 1: 609-2450AT45A100E
J3 = CMP-001-0013-A.3: Hirose U.FL SMT connector; Datasheet: https://www.hirose.com/product/en/download_file/key_name/U.FL/category/Catalog/doc_file_id/31697/?file_category_id=4&item_id=15&is_series=1; Drawing: https://www.hirose.com/product/en/download_file/key_name/U.FL-R-SMT-1%2810%29/category/Drawing%20(2D)/doc_file_id/37627/?file_category_id=6&item_id=03310472210&is_series=; Supplier 1: Mouser
L4-L6 = CMP-001-0101-A.4: as L1 on sheet LoRaAntenna; LifeCycleStateGUID: 706004B5-C76E-482E-903B-BA0E4FAE086A; ReleaseDate: 31/07/2017 06:40:06 PM; ContentTypeGUID: CB3C11C4-E317-11DF-B822-12313F0024A2; ItemGUID: 17F6FBB7-027A-4BA7-9144-FCD7399F32FE; ItemHRID: CMP-001-0101; FolderGUID: CF708A04-0EC7-4EEE-8F3D-D187CFC5366D; LifeCycle: New From Design
  L4: value: 5.1n; Supplier 1: Mouser
  L5 L6: value: NC

## Sheet EmbeddedPeripherals.SchDoc: Embedded Sensors
size A4; Engineer: David; DocumentNumber: 7; SheetNumber: 7; SheetTotal: 9; Project: SmartCanton Dev Box; Labo: LSN; PageSetup: Record=PageOptions|CenterHorizontal=True|CenterVertical=True|PrintScale=0.97|XCorrection=1.00|YCorrection=1.00|PrintKind=1|BorderSize=5000000|LeftOffset=0|BottomOffset=0|Orientation=2|PaperLength=1000|PaperWidth=1000|Scale=100|PaperSource=7|PrintQuality=-3|MediaType=1|DitherType=10|PrintScaleMode=1|PaperKind=A4 (210 x 297 mm)|PaperIndex=9
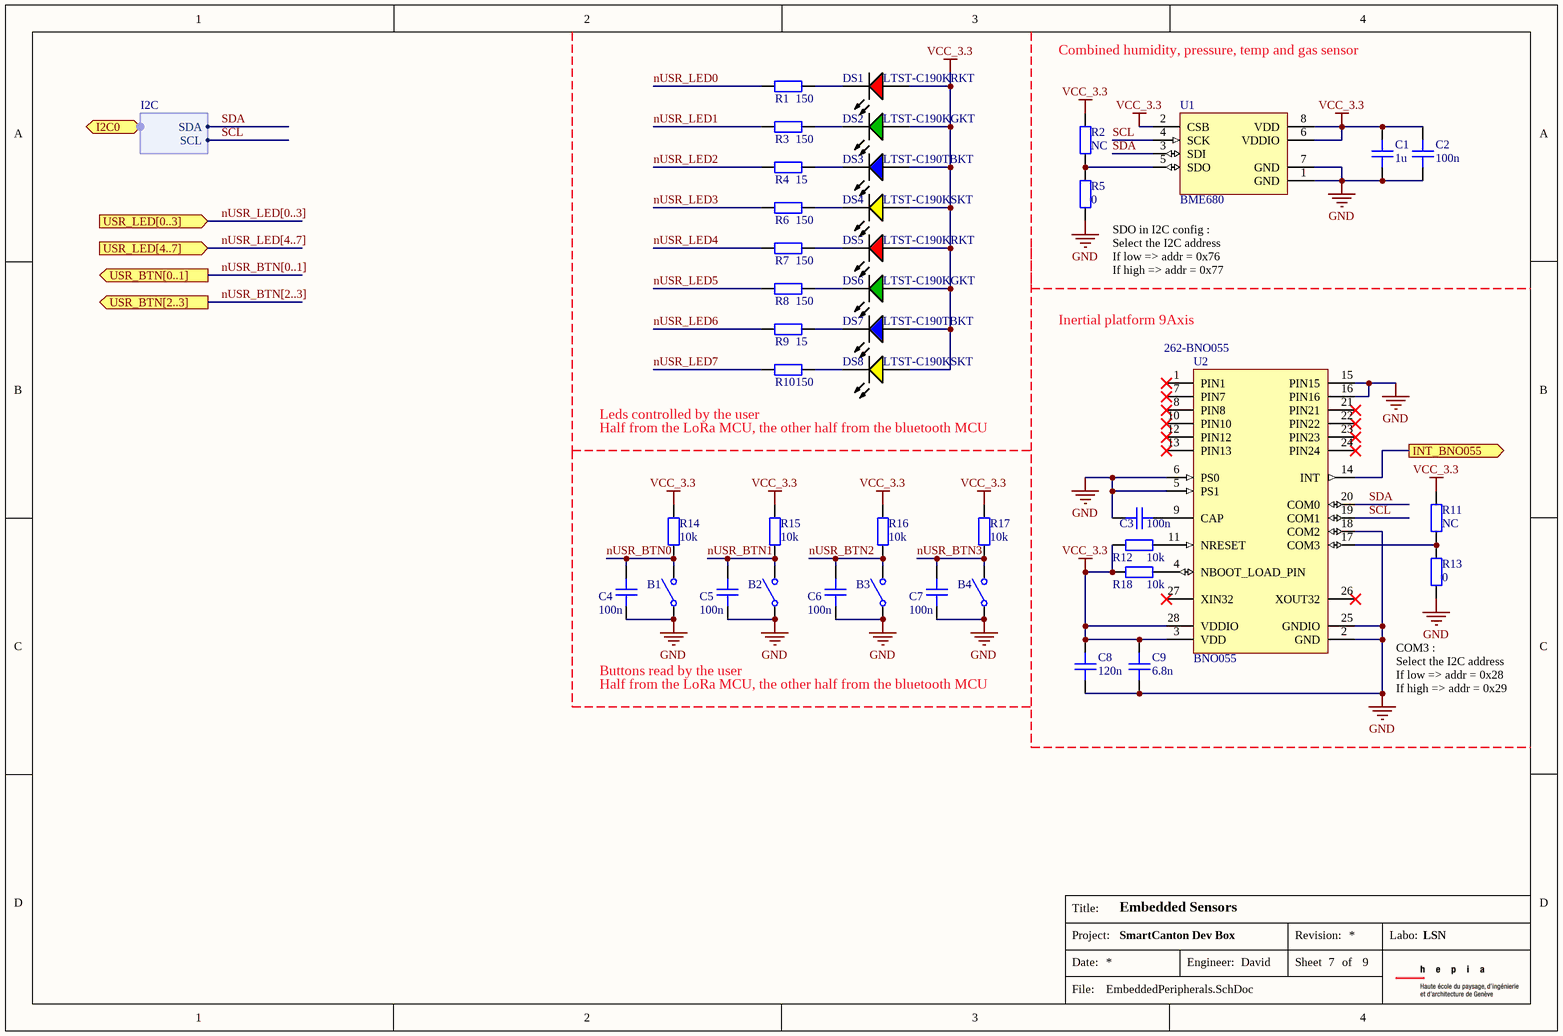
[diagram p7: EmbeddedPeripherals.SchDoc]

### Parts
B1  653-B3U-1000P  [B3U-1000P]  (value not drawn)
B2  653-B3U-1000P  [B3U-1000P]  (value not drawn)
B3  653-B3U-1000P  [B3U-1000P]  (value not drawn)
B4  653-B3U-1000P  [B3U-1000P]  (value not drawn)
C1  1u  [CAPC1608X08]
C2  100n  [CAPC1608X08]
C3  100n  [CAPC1608X08]
C4  100n  [CAPC1608X08]
C5  100n  [CAPC1608X08]
C6  100n  [CAPC1608X08]
C7  100n  [CAPC1608X08]
C8  120n  [CAPC1608X08]
C9  6.8n  [CAPC1608X08]
DS1  LTST-C190KRKT  [LTST-C191KRKT_V]
DS2  LTST-C190KGKT  [LITE-ON-LTST-C190GKT-2_V]
DS3  LTST-C190TBKT  [LTST-C190TBKT-2_V]
DS4  LTST-C190KSKT  [LTST-C190KSKT_V]
DS5  LTST-C190KRKT  [LTST-C191KRKT_V]
DS6  LTST-C190KGKT  [LITE-ON-LTST-C190GKT-2_V]
DS7  LTST-C190TBKT  [LTST-C190TBKT-2_V]
DS8  LTST-C190KSKT  [LTST-C190KSKT_V]
R1  150  [RESC1608X06]
R2  NC  [RESC1608X06]
R3  150  [RESC1608X06]
R4  15  [RESC1608X06]
R5  0  [RESC1608X06]
R6  150  [RESC1608X06]
R7  150  [RESC1608X06]
R8  150  [RESC1608X06]
R9  15  [RESC1608X06]
R10  150  [RESC1608X06]
R11  NC  [RESC1608X06]
R12  10k  [RESC1608X06]
R13  0  [RESC1608X06]
R14  10k  [RESC1608X06]
R15  10k  [RESC1608X06]
R16  10k  [RESC1608X06]
R17  10k  [RESC1608X06]
R18  10k  [RESC1608X06]
U1  BME680  [LGA-8-30x30x09]
U2  BNO055  Supplier Part Number 1: 262-BNO055  [BOSC-LGA-28_N]

### Ports
I2C0 (harness I2C), INT_BNO055 (out), USR_BTN[0..1] (out), USR_BTN[2..3] (out), USR_LED[0..3] (in), USR_LED[4..7] (in)

### Harnesses
I2C: SCL, SDA

### Nets
GND: B1.1 B2.1 B3.1 B4.1 C1.1 C2.1 C3.2 C4.2 C5.2 C6.2 C7.2 C8.1 C9.1 R5.1 R13.1 U1.1(GND) U1.7(GND) U2.2(GND) U2.5(PS1) U2.6(PS0) U2.15(PIN15) U2.16(PIN16) U2.18(COM2) U2.25(GNDIO)
VCC_3.3: C1.2 C2.2 C8.2 C9.2 DS1.1(A) DS2.1(A) DS3.1(A) DS4.1(A) DS5.1(A) DS6.1(A) DS7.1(A) DS8.1(A) R2.2 R11.2 R12.1 R14.2 R15.2 R16.2 R17.2 R18.1 U1.2(CSB) U1.6(VDDIO) U1.8(VDD) U2.3(VDD) U2.28(VDDIO)
INT_BNO055: U2.14(INT) ; port INT_BNO055
nUSR_BTN0: B1.2 C4.1 R14.1
nUSR_BTN1: B2.2 C5.1 R15.1
nUSR_BTN2: B3.2 C6.1 R16.1
nUSR_BTN3: B4.2 C7.1 R17.1
nUSR_LED0: R1.1
nUSR_LED1: R3.1
nUSR_LED2: R4.1
nUSR_LED3: R6.1
nUSR_LED4: R7.1
nUSR_LED5: R8.1
nUSR_LED6: R9.1
nUSR_LED7: R10.1
SCL: U1.4(SCK) U2.19(COM1) ; port I2C0.SCL  [project net I2C0_SCL]
SDA: U1.3(SDI) U2.20(COM0) ; port I2C0.SDA  [project net I2C0_SDA]
NetC3_1: C3.1 U2.9(CAP)
NetDS1_2: DS1.2(K) R1.2
NetDS2_2: DS2.2(K) R3.2
NetDS3_2: DS3.2(K) R4.2
NetDS4_2: DS4.2(K) R6.2
NetDS5_2: DS5.2(K) R7.2
NetDS6_2: DS6.2(K) R8.2
NetDS7_2: DS7.2(K) R9.2
NetDS8_2: DS8.2(K) R10.2
NetR2_1: R2.1 R5.2 U1.5(SDO)
NetR11_1: R11.1 R13.2 U2.17(COM3)
NetR12_2: R12.2 U2.11(NRESET)
NetR18_2: R18.2 U2.4(NBOOT_LOAD_PIN)

Not connected (* = marked no-connect by the designer): U2 1(PIN1)* 7(PIN7)* 8(PIN8)* 10(PIN10)* 12(PIN12)* 13(PIN13)* 21(PIN21)* 22(PIN22)* 23(PIN23)* 24(PIN24)* 26(XOUT32)* 27(XIN32)*

### Buses and harness runs
bus nUSR_BTN[0..1] = port USR_BTN[0..1]
bus nUSR_BTN[2..3] = port USR_BTN[2..3]
bus nUSR_LED[0..3] = port USR_LED[0..3]
bus nUSR_LED[4..7] = port USR_LED[4..7]

### Notes on the sheet
- Combined humidity, pressure, temp and gas sensor
- SDO in I2C config :
  Select the I2C address
  If low => addr = 0x76
  If high => addr = 0x77
- Inertial platform 9Axis
- (near R10) Leds controlled by the user
- Half from the LoRa MCU, the other half from the bluetooth MCU
- Buttons read by the user
- (near C8) Half from the LoRa MCU, the other half from the bluetooth MCU
- COM3 :
  Select the I2C address
  If low => addr = 0x28
  If high => addr = 0x29
- Title:
- Date:
- Project:
- Engineer:
- Revision:
- Sheet
- of
- Labo:
- File:

### Library data of the parts
B1-B4 = PUSH_BUTTON: Supplier 1: Mouser; Supplier Part Number 1: 653-B3U-1000P
C1 C2 = CMP-001-0010-A.3: as C32 on sheet MCU; ComponentType: Capacitor; ContentTypeGUID: CB3C11C4-E317-11DF-B822-12313F0024A2; FolderGUID: 9DA6C5B0-B134-4C0D-99DA-A840DED25FBD; ItemGUID: 6B05C9AF-D3C2-4723-98C2-0E51694C471A; ItemHRID: CMP-001-0010; LifeCycle: New From Design; LifeCycleStateGUID: 706004B5-C76E-482E-903B-BA0E4FAE086A; ReleaseDate: 31/10/2016 02:21:03 PM
  C1: Value: 1u
  C2: Value: 100n
C3-C9 = CMP-001-0010-A.3: as C24 on sheet MCU; LifeCycleStateGUID: 706004B5-C76E-482E-903B-BA0E4FAE086A; ReleaseDate: 31/10/2016 02:21:03 PM; ContentTypeGUID: CB3C11C4-E317-11DF-B822-12313F0024A2; ItemGUID: 6B05C9AF-D3C2-4723-98C2-0E51694C471A; ItemHRID: CMP-001-0010; FolderGUID: 9DA6C5B0-B134-4C0D-99DA-A840DED25FBD; LifeCycle: New From Design; ComponentType: Capacitor
  C3-C7: Value: 100n
  C8: Value: 120n
  C9: Value: 6.8n
DS1 DS5 = CMP-00027-A.1: LED Uni-Color Red, 62.5 mW, 5 V, -30 to 85 degC, 2-Pin SMD, RoHS, Tape and Reel; Capacitance: 100 uF; Voltage Rating: 50 V; Case\Package: Radial; Tolerance: 20%; Packaging: Bulk; REACH SVHC: No SVHC; ComponentLink1Description: Manufacturer URL; ComponentLink2URL: http://optoelectronics.liteon.com/upload/download/DS-22-99-0151/S_110_LTST-C190KRKT.pdf; Max Operating Temperature: 85 degC; DatasheetVersion: Rev. F, 05/2013; Pins: 2; Voltage Rating (DC): 50 V; Mount: Through Hole; Lead Pitch: 3.5 mm; Diameter: 8 mm; ComponentLink1URL: http://www.us.liteon.com/; Radiation Hardening: No; Package Quantity: 200; PackageReference: C191KRKT; RoHSCompliant: true; Height: 11.5 mm; PackageDescription: 2-Pin Surface Mount Device, Body 1.6 x 0.8 mm; Length: 11.5 mm; ComponentLink2Description: Datasheet; Min Operating Temperature: -40 degC; Supplier 1: Mouser; Supplier Part Number 1: 859-LTST-C190KRKT
DS2 DS6 = CMP-00026-A.1: as DS9 on sheet PowerSupply; Package Reference: C190KGKT; Mounting: SurfaceMount; Package Description: 2-Pin Surface Mount Device, Body 1.6 x 0.8 mm; Datasheet Version: Jul-15; Operating Temperature Classification: Industrial; Packaging: TapeandReel; Lens Dimensions: 1.1X0.8X0.52mm; Type: Uni-Color; Manufacturer URL: http://www.us.liteon.com/; Datasheet URL: http://datasheet.octopart.com/LTST-C190KGKT-Lite-On-datasheet-43775815.pdf; Product Height (mm): 0.8mm; Operating Temp Range: -55Cto85C; Pin Count: 2; Package Type: ChipLed; Lum Intensity: 35mcd; Supplier 1: Mouser; Supplier Part Number 1: 859-LTST-C190KGKT
DS3 DS7 = CMP-00021-A.1: Single Color Chip LED, 2.8 to 3.8 V, 28 to 180 mcd, -20 to 80 degC, 2-Pin SMD, RoHS, Tape and Reel; Nominal Supply Voltage: 3 V; Min Supply Voltage: 2.1 V; Interface: Serial; Case\Package: DFN; Max Supply Voltage: 3.6 V; Min Operating Temperature: -40 degC; ComponentLink2URL: http://optoelectronics.liteon.com/upload/download/DS-22-99-0224/S_110_LTST-C190TBKT(0630).pdf; Length: 3 mm; PackageReference: C190TBKT-2; Packaging: Cut Tape; RoHSCompliant: true; DatasheetVersion: Rev. K, 08/2011; Width: 3 mm; Pins: 6; Height: 1.1 mm; Max Operating Temperature: 125 degC; Mount: Surface Mount; PackageDescription: 2-Pin Surface Mount Device, Body 1.6 x 0.8 mm; ComponentLink1Description: Manufacturer URL; ComponentLink1URL: http://www.us.liteon.com/; REACH SVHC: No SVHC; ComponentLink2Description: Datasheet; Supplier 1: Mouser; Supplier Part Number 1: 859-LTST-C190TBKT
DS4 DS8 = CMP-00025-A.1: LED Uni-Color Yellow, 75 mW, 30 mA, -30 to 85 degC, 2-Pin SMD, RoHS, Tape and Reel; Voltage Rating: 50 V; Case\Package: 0603; Power Rating: 100 mW; Tolerance: 1%; Resistance: 12 kohm; Packaging: Tape and Reel; RoHSCompliant: true; Height: 0.45 mm; Max Operating Temperature: 155 degC; Mount: Surface Mount; DatasheetVersion: Rev. I, 10/2012; Min Operating Temperature: -55 degC; PackageReference: C190KSKT; ComponentLink1Description: Manufacturer URL; Length: 1.6 mm; REACH SVHC: No SVHC; Case Code (Imperial): 0603; Voltage Rating (DC): 50 V; PackageDescription: 2-Pin Surface Mount Device, Body 1.6 x 0.8 mm; Case Code (Metric): 1608; Package Quantity: 5000; ComponentLink2Description: Datasheet; Width: 0.8 mm; Pins: 2; ComponentLink2URL: http://optoelectronics.liteon.com/upload/download/DS-22-99-0189/S_110_LTST-C190KSKT.pdf; ComponentLink1URL: http://www.us.liteon.com/; Supplier 1: Mouser; Supplier Part Number 1: 859-LTST-C190KSKT
R1-R18 = CMP-001-0005-A.4: 1608 resistor
  R1 R3 R6-R8 R10: Value: 150
  R2 R11: Value: NC
  R4 R9: Value: 15
  R5 R13: Value: 0
  R12 R14-R18: Value: 10k
U1 = CMP-001-0107-A.4: Combined himidity, pressure, temp and gas sensor
U2 = CMP-00007-A.1: Intelligent 9-Axis Absolute Orientation Sensor, 1.7 V to 3.6 V, -40 to 85 degC, 28-Pin LGA, RoHS, Tape and Reel; Manufacturer: Bosch Sensortec; Manufacturer URL: http://www.bosch-sensortec.com; Datasheet URL: http://datasheet.octopart.com/BNO055-Bosch-datasheet-45840915.pdf; Datasheet Version: Rev. 1.3, 08/2015; Supplier 1: Mouser

## Sheet PMOD.SchDoc
size A4; DocumentNumber: 9; SheetNumber: 9; SheetTotal: 9; Project: Project name; Labo: LSN; PageSetup: Record=PageOptions|CenterHorizontal=True|CenterVertical=True|PrintScale=0.97|XCorrection=1.00|YCorrection=1.00|PrintKind=1|BorderSize=5000000|LeftOffset=0|BottomOffset=0|Orientation=2|PaperLength=1000|PaperWidth=1000|Scale=100|PaperSource=7|PrintQuality=-3|MediaType=1|DitherType=10|PrintScaleMode=1|PaperKind=A4 (210 x 297 mm)|PaperIndex=9
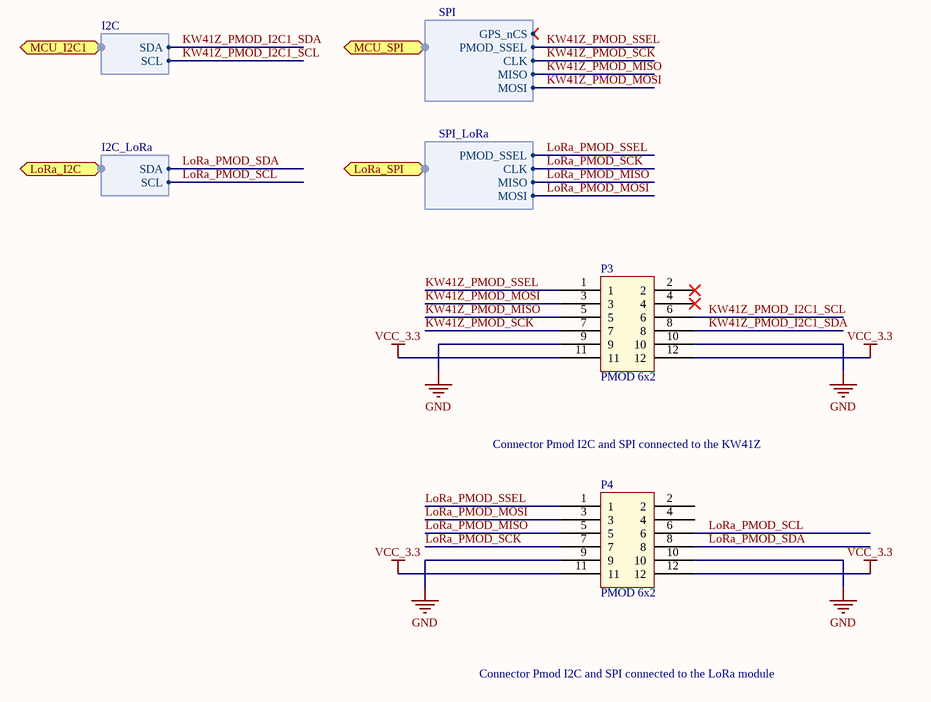
[diagram p8: PMOD.SchDoc]

### Parts
P3  PMOD 6x2  [PMOD SMD Header 6x2]
P4  PMOD 6x2  [PMOD SMD Header 6x2]

### Ports
LoRa_I2C (harness I2C_LoRa), LoRa_SPI (harness SPI_LoRa), MCU_I2C1 (harness I2C), MCU_SPI (harness SPI)

### Harnesses
I2C: SDA, SCL
SPI: PMOD_SSEL, CLK, MISO, MOSI, GPS_nCS
SPI_LoRa: PMOD_SSEL, CLK, MISO, MOSI
I2C_LoRa: SDA, SCL

### Nets
GND: P3.9 P3.10 P4.9 P4.10
VCC_3.3: P3.11 P3.12 P4.11 P4.12
KW41Z_PMOD_I2C1_SCL: P3.6 ; port MCU_I2C1.SCL  [project net I2C1_SCL]
KW41Z_PMOD_I2C1_SDA: P3.8 ; port MCU_I2C1.SDA  [project net I2C1_SDA]
KW41Z_PMOD_MISO: P3.5 ; port MCU_SPI.MISO
KW41Z_PMOD_MOSI: P3.3 ; port MCU_SPI.MOSI
KW41Z_PMOD_SCK: P3.7 ; port MCU_SPI.CLK
KW41Z_PMOD_SSEL: P3.1 ; port MCU_SPI.PMOD_SSEL
LoRa_PMOD_MISO: P4.5 ; port LoRa_SPI.MISO
LoRa_PMOD_MOSI: P4.3 ; port LoRa_SPI.MOSI
LoRa_PMOD_SCK: P4.7 ; port LoRa_SPI.CLK
LoRa_PMOD_SCL: P4.6 ; port LoRa_I2C.SCL
LoRa_PMOD_SDA: P4.8 ; port LoRa_I2C.SDA
LoRa_PMOD_SSEL: P4.1 ; port LoRa_SPI.PMOD_SSEL

Not connected (* = marked no-connect by the designer): P3 2* 4*; P4 2 4

### Notes on the sheet
- Connector Pmod I2C and SPI connected to the KW41Z
- Connector Pmod I2C and SPI connected to the LoRa module
- Title:
- Date:
- Project:
- Engineer:
- Revision:
- Sheet
- of
- Labo:
- File:

### Library data of the parts
P3 P4 = CMP-001-0115-A.1: Header, 6-Pin, Dual row

## Nets that join several sheets
GND: GPS (8 pins), MCU (37 pins), PowerSupply (26 pins), LoRa (27 pins), LoRaAntenna (6 pins), MCUAntenna (6 pins), EmbeddedPeripherals (24 pins), PMOD (P3.9 P3.10 P4.9 P4.10)
USB_5V: PowerSupply (D1.5 D3.A J4.1), LoRa (C13.2 C14.2 U4.4)
VCC_3.3: GPS (U3.8 U3.9 U3.22 U3.23), MCU (21 pins), PowerSupply (C45.1 L7.2 TP16.1 U8.3), LoRa (10 pins), EmbeddedPeripherals (25 pins), PMOD (P3.11 P3.12 P4.11 P4.12)
ANT: LoRa (U4.26), LoRaAntenna (C20.2 C22.1 L1.1)
ANT_MKW41Z: MCU (U5.33), MCUAntenna (C35.2 C37.1 L4.1)
BAT_LEVEL: MCU (U5.23), PowerSupply (C40.2 R31.1 R32.2)
GPS_nCS: GPS (U3.18), MCU (TP2.1 U5.41)
I2C0_SCL: MCU (R24.1 TP9.1 U5.16), EmbeddedPeripherals (U1.4 U2.19)
I2C0_SDA: MCU (R23.1 TP8.1 U5.17), EmbeddedPeripherals (U1.3 U2.20)
I2C1_SCL: MCU (R26.1 TP11.1 U5.42), PMOD (P3.6)
I2C1_SDA: MCU (R25.1 TP10.1 U5.43), PMOD (P3.8)
INT_BNO055: MCU (U5.48), EmbeddedPeripherals (U2.14)
KW41Z_PMOD_MISO: GPS (U3.20), MCU (TP4.1 U5.47), PMOD (P3.5)
KW41Z_PMOD_MOSI: GPS (U3.21), MCU (TP5.1 U5.46), PMOD (P3.3)
KW41Z_PMOD_SCK: GPS (U3.19), MCU (TP3.1 U5.45), PMOD (P3.7)
KW41Z_PMOD_SSEL: MCU (TP1.1 U5.40), PMOD (P3.1)
LoRa_PMOD_MISO: LoRa (TP21.1 U4.15), PMOD (P4.5)
LoRa_PMOD_MOSI: LoRa (TP22.1 U4.14), PMOD (P4.3)
LoRa_PMOD_SCK: LoRa (TP19.1 U4.16), PMOD (P4.7)
LoRa_PMOD_SCL: LoRa (TP20.1 U4.35), PMOD (P4.6)
LoRa_PMOD_SDA: LoRa (TP18.1 U4.36), PMOD (P4.8)
LoRa_PMOD_SSEL: LoRa (TP17.1 U4.17), PMOD (P4.1)
TIMEPULSE: GPS (U3.3), MCU (U5.37)
UART0_RX: MCU (TP7.1 U5.38), LoRa (U4.18)
UART0_TX: MCU (TP6.1 U5.39), LoRa (U4.19)
USB_D_N: PowerSupply (D1.3 D1.4 J4.2), LoRa (U4.2)
USB_D_P: PowerSupply (D1.1 D1.6 J4.3), LoRa (U4.1)